# Altium project L-LRMAM36-FANN4-DK01_V03.PrjPCB
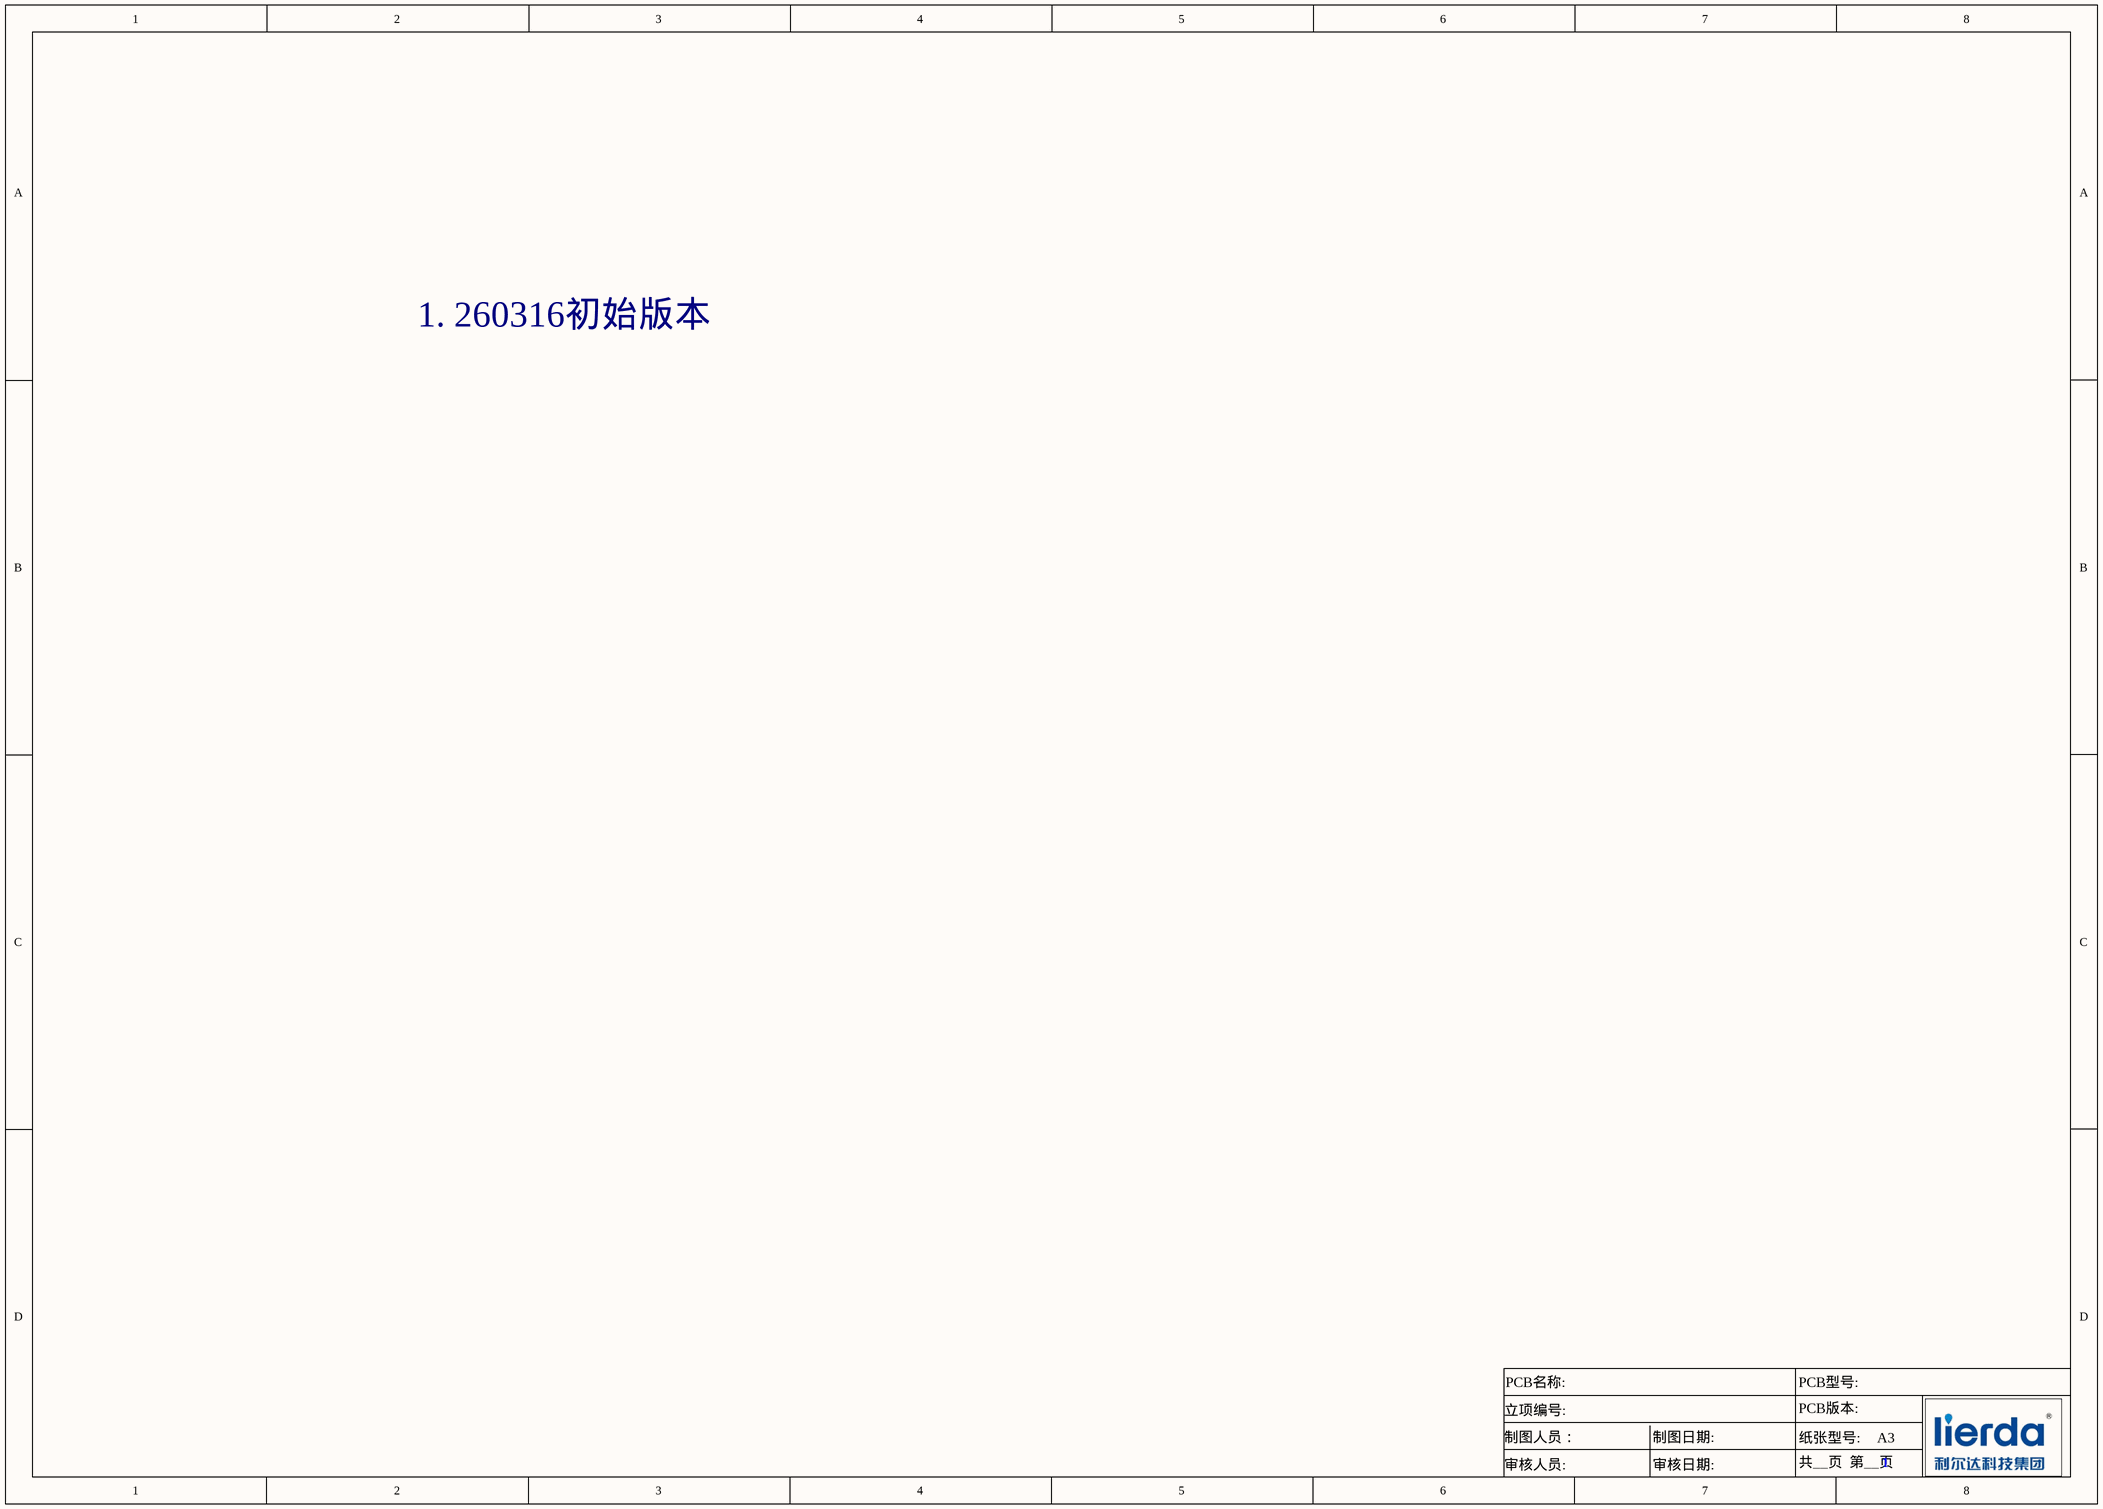
[diagram p0: 01_ChangeLIST.SchDoc]
6 sheets, 276 parts. Net scope: global (net labels, ports and power ports of the same name join across sheets).
Board files: L-LRMAM36-FANN4-DK01-0402-03.PcbDoc, L-LRMAM36-FANN4-DK01_V03.PcbDoc
Sheets:
  01_ChangeLIST.SchDoc
  02_Block.SchDoc
  03_Power_260316_V02.SchDoc
  04_Function_260316_V02.SchDoc
  05_Codec&PA.SchDoc
  06_LCD&Camera_interface.SchDoc

## Sheet 01_ChangeLIST.SchDoc
size A3

### Notes on the sheet
- 1. 260316初始版本
- PCB名称:
- PCB型号:
- 制图人员：
- 立项编号:
- 制图日期:
- PCB版本:
- 纸张型号:
- A3
- 审核人员:
- 审核日期:
- 共__页  第__页
- 1

## Sheet 02_Block.SchDoc
size A3
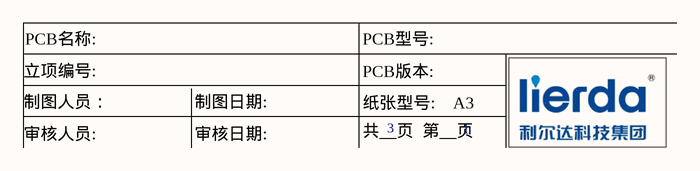
[diagram p1: 02_Block.SchDoc]

### Notes on the sheet
- PCB名称:
- PCB型号:
- 制图人员：
- 立项编号:
- 制图日期:
- 纸张型号:
- PCB版本:
- 3
- A3
- 1
- 审核人员:
- 审核日期:
- 共__页  第__页

## Sheet 03_Power_260316_V02.SchDoc
size A3
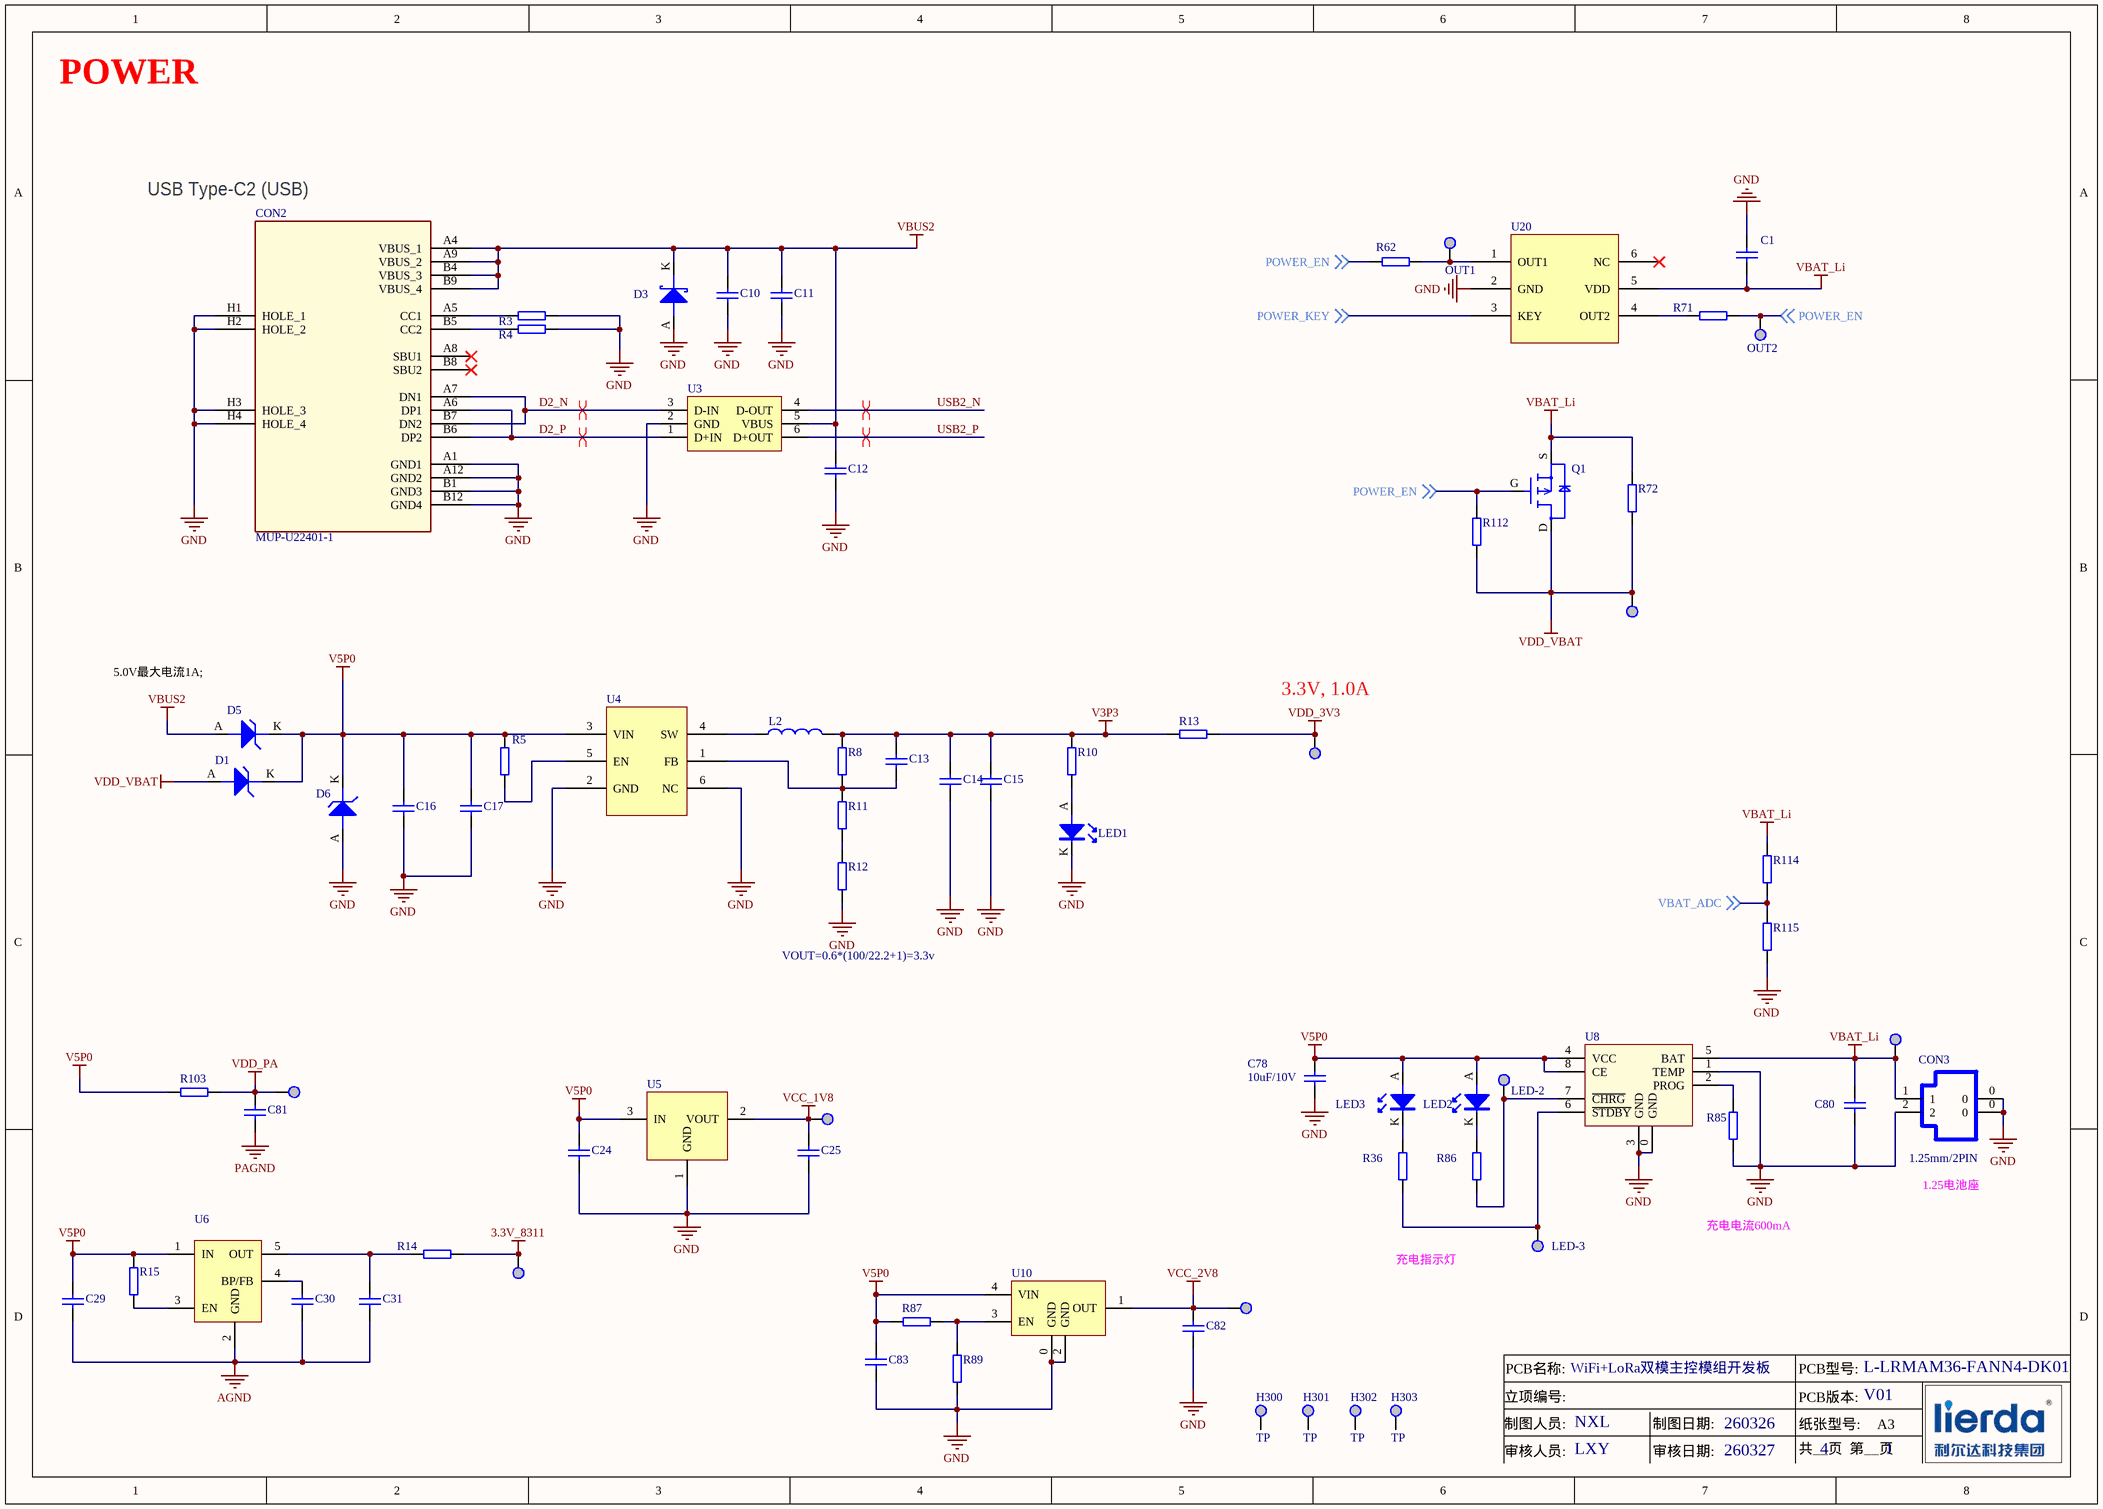
[diagram p2: 03_Power_260316_V02.SchDoc]

### Parts
C1  2.2uF  [0402C_0.4D]  (value not drawn)
C10  4.7uF/16V  [0402C_0.4D]  (value not drawn)
C11  0.1uF/16V  [0402C_0.4D]  (value not drawn)
C12  0.1uF  [0402C_0.4D]  (value not drawn)
C13  20pF  [0402C_0.4D]  (value not drawn)
C14  22uF  [0603C_0.6D]  (value not drawn)
C15  10uF/10V  [0402C_0.4D]  (value not drawn)
C16  4.7uF/16V  [0402C_0.4D]  (value not drawn)
C17  1uF/16V  [0402C_0.4D]  (value not drawn)
C24  1uF/16V  [0402C_0.4D]  (value not drawn)
C25  1uF/16V  [0402C_0.4D]  (value not drawn)
C29  1uF/16V  [0402C_0.4D]  (value not drawn)
C30  10nF  [0402C_0.4D]  (value not drawn)
C31  1uF/16V  [0402C_0.4D]  (value not drawn)
C78  产品型号: 10uF/10V  [0402C_0.4D]  (hidden comment: CAP-NP)
C80  CAP-NP  [0402C_0.4D]  (value not drawn)
C81  10uF/10V  [0402C_0.4D]  (value not drawn)
C82  1uF/16V  [0402C_0.4D]  (value not drawn)
C83  2.2uF  [0402C_0.4D]  (value not drawn)
CON2  产品型号: MUP-U22401-1  [USB-TYPEC-U22401-1]  (hidden comment: USB-TYPE C-16)
CON3  FPC-2  [SMD-1.25-2P]  (value not drawn)
D1  DIODE-ZD  [SOD-123-FL]  (value not drawn)
D3  DIODE-TVS  [UDFN2(1610)]  (value not drawn)
D5  DIODE-ZD  [SOD-123-FL]  (value not drawn)
D6  DIODE-ZD  [SOD-123]  (value not drawn)
H300  TP  [M2.5]
H301  TP  [M2.5]
H302  TP  [M2.5]
H303  TP  [M2.5]
L2  2.2uH/20%/2.0*1.2*0.8/1.7A/146mΩ  [0805L_0.7D-NB]  (value not drawn)
LED1  *  [D0603]  (value not drawn)
LED2  红/25mA  [D0603]  (value not drawn)
LED3  绿/25mA  [D0603]  (value not drawn)
LED-2  MARK  [TEST]  (value not drawn)
LED-3  MARK  [TEST]  (value not drawn)
OUT1  MARK  [TEST]  (value not drawn)
OUT2  MARK  [TEST]  (value not drawn)
Q1  P-MOS-D1  [SOT-23-3G]  (value not drawn)
R3  5.1K/1%  [0402R_0.4D]  (value not drawn)
R4  5.1K/1%  [0402R_0.4D]  (value not drawn)
R5  51KΩ/1%  [0402R_0.4D]  (value not drawn)
R8  100KΩ/1%  [0402R_0.4D]  (value not drawn)
R10  620R  [0402R_0.4D]  (value not drawn)
R11  22KΩ  [0402R_0.4D]  (value not drawn)
R12  220Ω/1%  [0402R_0.4D]  (value not drawn)
R13  RES  [0805R_0.6D]  (value not drawn)
R14  0Ω/1%  [0402R_0.4D]  (value not drawn)
R15  10KΩ/5%  [0402R_0.4D]  (value not drawn)
R36  RES  [0402R_0.4D]  (value not drawn)
R62  0Ω/1%  [0402R_0.4D]  (value not drawn)
R71  0Ω/1%  [0402R_0.4D]  (value not drawn)
R72  RES  [0805R_0.6D]  (value not drawn)
R85  RES  [0402R_0.4D]  (value not drawn)
R86  RES  [0402R_0.4D]  (value not drawn)
R87  10KΩ/5%  [0402R_0.4D]  (value not drawn)
R89  10KΩ/5%  [0402R_0.4D]  (value not drawn)
R103  RES  [0805R_0.6D]  (value not drawn)
R112  NC  [0402R_0.4D]  (value not drawn)
R114  1MΩ/1%  [0402R_0.4D]  (value not drawn)
R115  1MΩ/1%  [0402R_0.4D]  (value not drawn)
TP_LDO1  TP  [TEST]  (value not drawn)
TP_VBAT1  TP  [TEST]  (value not drawn)
U3  USBLC6-2SC6  [SOT-23-6P]  (value not drawn)
U4  SGM61020XKB6G/TR  [SOT-563-6]  (value not drawn)
U5  LDO-1G2OUT3IN  [SOT-23-3P]  (value not drawn)
U6  SGM2028-XYN5G/TR  [SOT-23-5P]  (value not drawn)
U8  TP4056  [SOP-8(1.27)-GND]  (value not drawn)
U10  ETA5053V280DF1E  [XDFN4-1X1]  (value not drawn)
U20  EC190708-4-A427  [SOT-23-6P]  (value not drawn)
VDD_1V8  MARK  [TEST]  (value not drawn)
VDD_2V8  MARK  [TEST]  (value not drawn)
VDD_PA  MARK  [TEST]  (value not drawn)
VDD_VBAT  MARK  [TEST]  (value not drawn)
VDD_WiFi  MARK  [TEST]  (value not drawn)

### Nets
3.3V_8311: R14.2 TP_LDO1.1
AGND: C29.1 C30.1 C31.1 U6.2(GND)  [project net MIC_N]
GND: C1.1 C10.1 C11.1 C12.1 C14.1 C15.1 C16.1 C17.1 C24.1 C25.1 C78.1 C80.1 C82.1 C83.1 CON2.A1(GND1) CON2.A12(GND2) CON2.B1(GND3) CON2.B12(GND4) CON2.H1(HOLE_1) CON2.H2(HOLE_2) CON2.H3(HOLE_3) CON2.H4(HOLE_4) CON3.0 CON3.2 D3.A D6.A LED1.K R3.1 R4.1 R12.1 R85.1 R89.1 R115.1 U3.2(GND) U4.2(GND) U4.6(NC) U5.1(GND) U8.0(GND) U8.1(TEMP) U8.3(GND) U10.0(GND) U10.2(GND) U20.2(GND)
PAGND: C81.1
V3P3: C13.2 C14.2 C15.2 L2.2 R8.2 R10.2 R13.2
V5P0: C16.2 C17.2 C24.2 C29.2 C78.2 C83.2 D1.K D5.K D6.K LED2.A LED3.A R5.2 R15.2 R87.2 R103.2 U4.3(VIN) U5.3(IN) U6.1(IN) U8.4(VCC) U8.8(CE) U10.4(VIN)
VBAT_Li: C1.2 C80.2 CON3.1 Q1.S R72.1 R114.2 TP_VBAT1.1 U8.5(BAT) U20.5(VDD)
VBUS2: C10.2 C11.2 C12.2 CON2.A4(VBUS_1) CON2.A9(VBUS_2) CON2.B4(VBUS_3) CON2.B9(VBUS_4) D3.K D5.A U3.5(VBUS)
VCC_1V8: C25.2 U5.2(VOUT) VDD_1V8.1
VCC_2V8: C82.2 U10.1(OUT) VDD_2V8.1
VDD_3V3: R13.1 VDD_WiFi.1
VDD_PA: C81.2 R103.1 VDD_PA.1
VDD_VBAT: D1.A Q1.D R72.2 R112.1 VDD_VBAT.1
D2_N: CON2.A7(DN1) CON2.B7(DN2) U3.3(D-IN)
D2_P: CON2.A6(DP1) CON2.B6(DP2) U3.1(D+IN)
POWER_EN: OUT2.1 Q1.G R62.1 R71.2 R112.2 ; off-sheet POWER_EN
POWER_KEY: U20.3(KEY) ; off-sheet POWER_KEY
USB2_N: U3.4(D-OUT)
USB2_P: U3.6(D+OUT)
VBAT_ADC: R114.1 R115.2 ; off-sheet VBAT_ADC
NetC13_1: C13.1 R8.1 R11.2 U4.1(FB)
NetC30_2: C30.2 U6.4(BP/FB)
NetC31_2: C31.2 R14.1 U6.5(OUT)
NetCON2_A5: CON2.A5(CC1) R3.2
NetCON2_B5: CON2.B5(CC2) R4.2
NetL2_1: L2.1 U4.4(SW)
NetLED1_A: LED1.A R10.1
NetLED2_K: LED2.K R86.2
NetLED3_K: LED3.K R36.2
NetLED-2_1: LED-2.1 R86.1 U8.7(~{CHRG})
NetLED-3_1: LED-3.1 R36.1 U8.6(~{STDBY})
NetOUT1_1: OUT1.1 R62.2 U20.1(OUT1)
NetR5_1: R5.1 U4.5(EN)
NetR11_1: R11.1 R12.2
NetR15_1: R15.1 U6.3(EN)
NetR71_1: R71.1 U20.4(OUT2)
NetR85_2: R85.2 U8.2(PROG)
NetR87_1: R87.1 R89.2 U10.3(EN)

Not connected (* = marked no-connect by the designer): CON2 A8(SBU1)* B8(SBU2)*; H300 1; H301 1; H302 1; H303 1; U20 6(NC)*

### Layout directives
differential pair: D2_N, D2_P, USB2_N, USB2_P

### Notes on the sheet
- POWER
- (near CON2) USB Type-C2 (USB)
- 5.0V最大电流1A;
- (near VDD_WiFi) 3.3V, 1.0A
- VOUT=0.6*(100/22.2+1)=3.3v
- 1.25电池座
- 充电指示灯
- 充电电流600mA
- PCB名称:
- WiFi+LoRa双模主控模组开发板
- PCB型号:
- L-LRMAM36-FANN4-DK01
- 制图人员:
- 审核人员:
- 立项编号:
- NXL
- LXY
- 制图日期:
- 审核日期:
- 260326
- 260327
- 纸张型号:
- 共__页  第__页
- PCB版本:
- 4
- V01
- A3
- 1

### Library data of the parts
C1 C16 C83 = 1405002483: 4.7uF/16V/20%/X5R; 产品型号: CL05A475MO5NUNC; 品名: 陶瓷电容; 原厂品牌: SAMSUNG电容; 封装: 0402; 存货编码: 1405002483
C10 = 1405002483: 4.7uF/16V/20%/X5R; 产品型号: CL05A475MO5NUNC; 器件名称: 陶瓷电容; 原厂品牌: SAMSUNG电容; 封装: 0402; 存货编码: 1405002483
C11 = 1405000464: 0.1uF/16V/10%/X7R; 产品型号: CL05B104KO5NNNC; 品名: 陶瓷电容; 原厂品牌: SAMSUNG; 封装: 0402; 物料状态: 优选; 存货编码: 1405000464
C12 = 1405000041: 0.1uF/16V/10%/X7R; 产品型号: CC0402KRX7R7BB104; 器件名称: 陶瓷电容; 原厂品牌: YAGEO; 封装: 0402; 存货编码: 1405000041
C13 = 1405001560: 20pF/50V/5%/C0G; 产品型号: V200J0402C0G500NBT; 品名: 陶瓷电容; 原厂品牌: 微容VIIYONG; 封装: 0402; 物料状态: 优选; 存货编码: 1405001560
C14 = 1405001346: 22uF/10V/20%/X5R; 产品型号: CL10A226MP8NUN#; 品名: 陶瓷电容; 原厂品牌: SAMSUNG电容; 封装: 0603; 存货编码: 1405001346
C15 C81 = 1405001308: 10uF/10V/20%/X5R; 产品型号: CL05A106MP5NUNC; 品名: 陶瓷电容; 原厂品牌: SAMSUNG电容; 封装: 0402; 存货编码: 1405001308
C17 C24 C25 C29 C31 C82 = 1405004038: 1uF/16V/10%/X5R; 产品型号: CL05A105KO5NNNC; 品名: 陶瓷电容; 原厂品牌: SAMSUNG电容; 封装: 0402; 存货编码: 1405004038
C30 = 1405005232: 10nF/16V/10%/X7R; 产品型号: V103K0402X7R160NBT; 品名: 陶瓷电容; 原厂品牌: 微容VIIYONG; 封装: 0402; 物料状态: 优选; 存货编码: 1405005232
C78 C80 = 1405001308: 10uF/10V/20%/X5R; 品名: 陶瓷电容; 原厂品牌: 三星; 封装: 0402; 物料状态: 优选; 存货编码: 1405001308
  C80: 产品型号: 10uF/10V
CON2 = 1416004328: TYPE C; 品名: USB连接器; 原厂品牌: 德海威; 封装: SMD; 物料状态: 优选; 存货编码: 1416004328
CON3 = 1416001814: 1.25mm/2PIN; 品名: 线对板连接器; 原厂品牌: 肯耐特; 封装: SMD; 物料状态: 优选; 产品型号: 1.25mm/2PIN; 存货编码: 1416001814
D1 D5 = 1409001653: 40V/3A; 产品型号: S34; 品名: 肖特基二极管; 原厂品牌: YJ; 封装: SOD-123FL; 物料状态: 优选; 存货编码: 1409001653
D3 = 1409004319: 1通道; 产品型号: WS6.3DPX; 品名: ESD保护器件; 原厂品牌: WAYON（维安）; 封装: DFN1610-2L; 物料状态: 优选; 存货编码: 1409004319
D6 = 1409000809: 5.6V/0.5W; 产品型号: LBZT52C5V6T1G; 品名: 稳压二极管; 原厂品牌: LRC; 物料状态: 优选; 存货编码: 1409000809; 封装: SOD-123
L2 = 1404002926: 产品型号: SKFB201208PA2R2M; 品名: 功率电感; 原厂品牌: 三体Scientic; 封装: 0805; 物料状态: 试用; 存货编码: 1404002926
LED1 = 1409000426: 红/25mA; 产品型号: 19-213SURC-S530-A2-TR8; 器件名称: 发光二极管; 原厂品牌: EVERLIGHT; 封装: 0603; 存货编码: 1409000426
LED2 LED3 = 1409000351: 绿/25mA/112-285mcd; 产品型号: 19-217/GHC-YR1S2/6T; 品名: LED发光二极管; 原厂品牌: EVERLIGHT; 封装: 0603; 物料状态: 优选; 存货编码: 1409000351
Q1 = 1412000739: PMOS/30V/4.2A; 产品型号: CJ3401; 品名: MOS管; 原厂品牌: CJ; 封装: SOT-23; 物料状态: 优选; 存货编码: 1412000739
R3 R4 = 1408001245: 5.1K/1%/100PPM; 产品型号: RC0402FR-075K1L; 品名: 厚膜贴片电阻; 原厂品牌: YAGEO; 封装: 0402; 存货编码: 1408001245
R5 = 1408001200: 产品型号: 0402WGF5102TCE; 品名: 厚膜贴片电阻; 原厂品牌: Uniohm; 封装: 0402; 物料状态: 优选; 存货编码: 1408001200
R8 = 1408000126: 产品型号: 0402WGF1003TCE; 品名: 厚膜贴片电阻; 原厂品牌: Uniohm; 封装: 0402; 物料状态: 优选; 存货编码: 1408000126
R10 = 1408006136: 620R/5%; 产品型号: 0402WGJ0621TCE; 品名: 厚膜贴片电阻; 原厂品牌: Uniohm; 封装: 0402; 物料状态: 限用; 存货编码: 1408006136
R11 R112 = 1408000783: 22KΩ/1%; 产品型号: 0402WGF2202TCE; 品名: 厚膜贴片电阻; 原厂品牌: Uniohm; 封装: 0402; 物料状态: 优选; 存货编码: 1408000783
R12 = 1408001062: 产品型号: RC0402FR-07220RL; 品名: 厚膜贴片电阻; 原厂品牌: YAGEO; 封装: 0402; 物料状态: 优选; 存货编码: 1408001062
R13 R72 = 1408000487: 0Ω/1%; 产品型号: 0R; 品名: 厚膜贴片电阻; 原厂品牌: Uniohm; 封装: 0805; 物料状态: 优选; 存货编码: 1408000487
R14 R62 R71 = 1408000124: 产品型号: 0402WGF0000TCE; 品名: 厚膜贴片电阻; 原厂品牌: Uniohm; 封装: 0402; 物料状态: 优选; 存货编码: 1408000124
R15 R87 R89 = 1408000526: 产品型号: 0402WGJ0103TCE; 品名: 厚膜贴片电阻; 原厂品牌: Uniohm; 封装: 0402; 物料状态: 优选; 存货编码: 1408000526
R36 R86 = 1408000535: 1KΩ/5%; 产品型号: 620R; 品名: 厚膜贴片电阻; 原厂品牌: Uniohm; 封装: 0402; 物料状态: 优选; 存货编码: 1408000535
R85 = 1408000223: 2KΩ/5%; 产品型号: 2K; 品名: 厚膜贴片电阻; 原厂品牌: Uniohm; 封装: 0402; 物料状态: 优选; 存货编码: 1408000223
R103 = 1408000487: 0Ω/1%; 品名: 厚膜贴片电阻; 原厂品牌: Uniohm; 封装: 0805; 物料状态: 优选; 存货编码: 1408000487
R114 R115 = 1408000713: 产品型号: 0402WGF1004TCE; 品名: 厚膜贴片电阻; 原厂品牌: Uniohm; 封装: 0402; 物料状态: 优选; 存货编码: 1408000713
U3 = 1410003301: USB保护芯片; 品名: ESD保护二极管; 原厂品牌: ST; 封装: SOT-23-6; 产品型号: USBLC6-2SC6; 存货编码: 1410003301
U5 = 1407003557: 1.8V/250mA/1.7-7.5V; 产品型号: SGM2034-1.8YN3G/TR; 品名: 低压差线性稳压器; 原厂品牌: 圣邦微; 封装: SOT-23-3; 物料状态: 优选; 存货编码: 1407003557
U6 = 1407001780: 3.3V/500mA/2.5-5.5V; 产品型号: SGM2028-3.3YN5G/TR; 品名: 低压差线性稳压器; 原厂品牌: SGMICRO; 封装: SOT-23-5; 物料状态: 优选; 存货编码: 1407001780
U8 = 1407000458: -/1A; 品名: 电池管理IC; 原厂品牌: 南京拓微; 封装: SOP8; 物料状态: 优选; 产品型号: TP4056; 存货编码: 1407000458
U10 = 1407004220: 2.8V/300mA/1.6-6V; 品名: 低压差线性稳压器; 原厂品牌: 钰泰科技; 封装: DFN4; 物料状态: 优选; 产品型号: ETA5053V280DF1E; 存货编码: 1407004220
H300-H303 TP_LDO1 TP_VBAT1 = TP: 产品型号: TP

## Sheet 04_Function_260316_V02.SchDoc
size A3
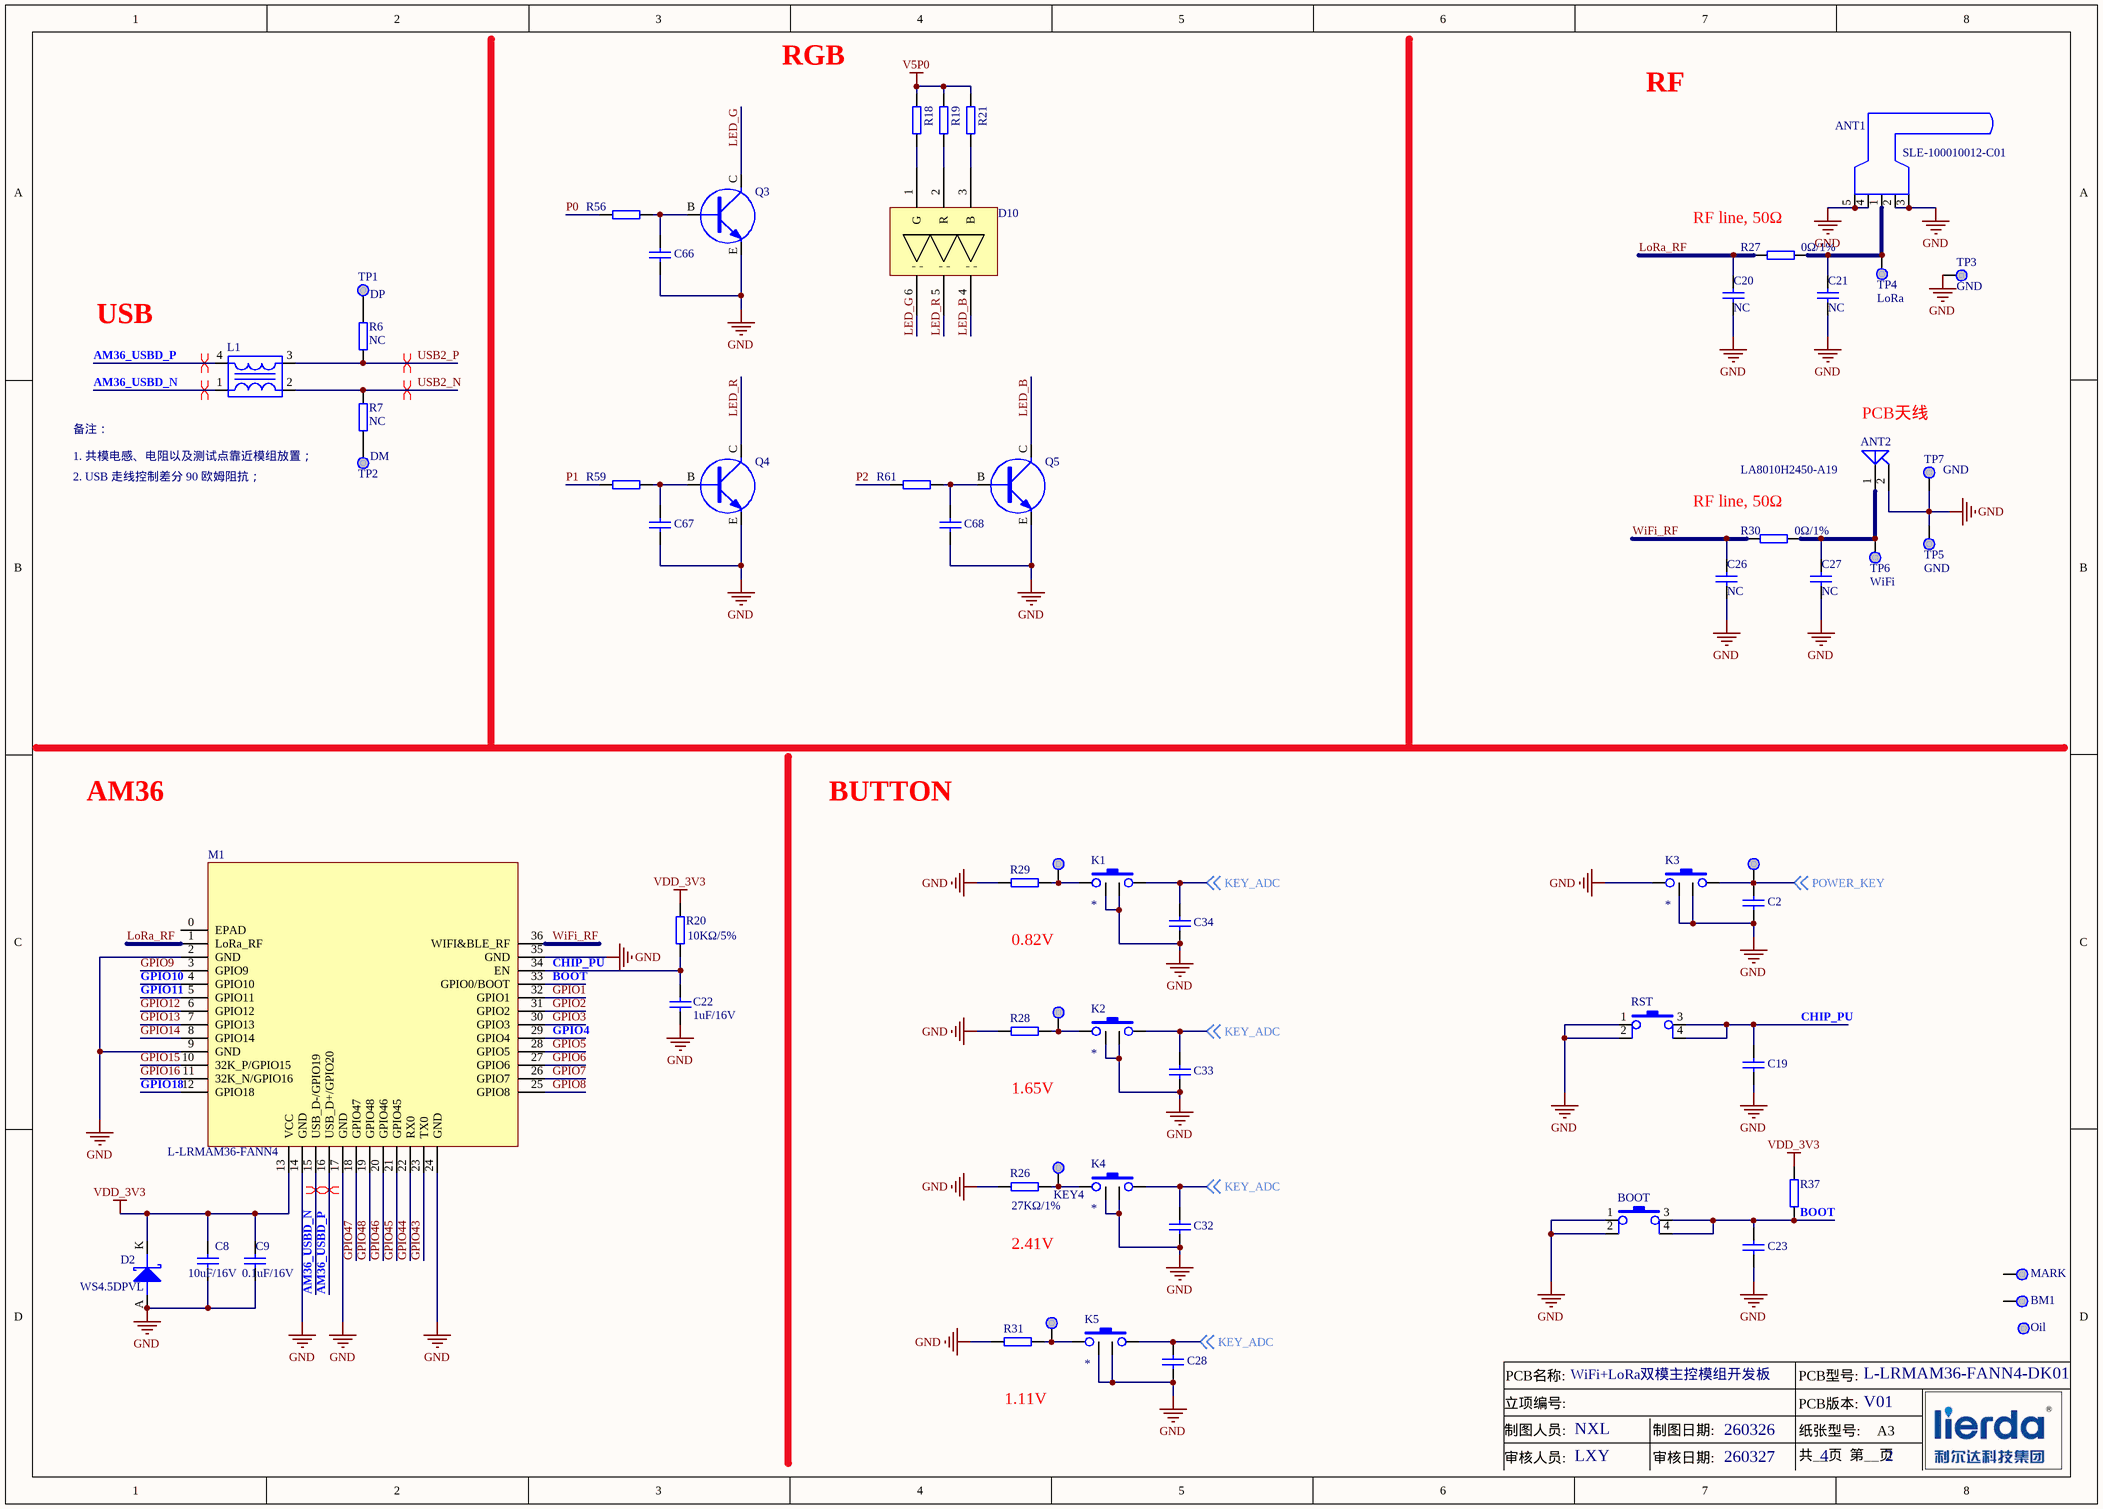
[diagram p3: 04_Function_260316_V02.SchDoc]

### Parts
ANT1  产品型号: SLE-100010012-C01  [SMA-SMD]  (hidden comment: ANT P5)
ANT2  产品型号: LA8010H2450-A19  [2.4G_5.5X12]  (hidden comment: ANT 2P)
BM1  BadMARK  [Bad Mark]  (value not drawn)
BOOT  BUTTON-4  [SW-4.2X3.2-4P-S]  (value not drawn)
C2  NC  [0402C_0.4D]  (value not drawn)
C8  10uF/16V  [0402C_0.4D]
C9  0.1uF/16V  [0402C_0.4D]
C19  100pF  [0402C_0.4D]  (value not drawn)
C20  NC  [0402C_0.4D]
C21  NC  [0402C_0.4D]
C22  1uF/16V  [0402C_0.4D]
C23  100pF  [0402C_0.4D]  (value not drawn)
C26  NC  [0402C_0.4D]
C27  NC  [0402C_0.4D]
C28  100pF  [0402C_0.4D]  (value not drawn)
C32  100pF  [0402C_0.4D]  (value not drawn)
C33  100pF  [0402C_0.4D]  (value not drawn)
C34  100pF  [0402C_0.4D]  (value not drawn)
C66  100pF  [0402C_0.4D]  (value not drawn)
C67  100pF  [0402C_0.4D]  (value not drawn)
C68  100pF  [0402C_0.4D]  (value not drawn)
D2  产品型号: WS4.5DPVL  [UDFN2(1610)]  (hidden comment: DIODE-TVS)
D10  MHP5050DRGBCT  [D5050-RGB]  (value not drawn)
K1  BUTTON-2-2  [1188E-1W3-V-T/R]  (value not drawn)
K2  BUTTON-2-2  [1188E-1W3-V-T/R]  (value not drawn)
K3  BUTTON-2-2  [1188E-1W3-V-T/R]  (value not drawn)
K4  BUTTON-2-2  [1188E-1W3-V-T/R]  (value not drawn)
K5  BUTTON-2-2  [1188E-1W3-V-T/R]  (value not drawn)
KEY3  MARK  [TEST]  (value not drawn)
KEY4  MARK  [TEST]  (value not drawn)
KEY5  MARK  [TEST]  (value not drawn)
KEY6  MARK  [TEST]  (value not drawn)
KEY7  MARK  [TEST]  (value not drawn)
L1  DLM0NSN900HY2D  [L-0.85X0.65]  (value not drawn)
M1  L-LRMAM36-FANN4  [L-LRMAM36-FANN4]
MK1  MARK  [MARK]
Oil1  Oil  [White oil-9X9]
Q3  NPN  [SOT-723-3A]  (value not drawn)
Q4  NPN  [SOT-723-3A]  (value not drawn)
Q5  NPN  [SOT-723-3A]  (value not drawn)
R6  产品型号: NC  [0201_0.25D]  (hidden comment: RES-NBOM)
R7  产品型号: NC  [0201_0.25D]  (hidden comment: RES-NBOM)
R18  620R  [0402R_0.4D]  (value not drawn)
R19  620R  [0402R_0.4D]  (value not drawn)
R20  10KΩ/5%  [0402R_0.4D]
R21  620R  [0402R_0.4D]  (value not drawn)
R26  27KΩ/1%  [0402R_0.4D]
R27  0Ω/1%  [0402R_0.4D]
R28  10KΩ/1%  [0402R_0.4D]  (value not drawn)
R29  3.3KΩ/1%  [0402R_0.4D]  (value not drawn)
R30  0Ω/1%  [0402R_0.4D]
R31  5.1KΩ/1%  [0402R_0.4D]  (value not drawn)
R37  10KΩ/1%  [0402R_0.4D]  (value not drawn)
R56  0Ω/1%  [0402R_0.4D]  (value not drawn)
R59  0Ω/1%  [0402R_0.4D]  (value not drawn)
R61  0Ω/1%  [0402R_0.4D]  (value not drawn)
RST  BUTTON-4  [SW-4.2X3.2-4P-S]  (value not drawn)
TP1  DP  [TEST]
TP2  DM  [TEST]
TP3  GND  [TEST]
TP4  LoRa  [TEST]
TP5  GND  [TEST]
TP6  WiFi  [TEST]
TP7  GND  [TEST]

### Nets
GND: ANT1.2 ANT1.3 ANT1.4 ANT1.5 ANT2.2 BOOT.1 BOOT.2 C2.1 C8.1 C9.1 C19.1 C20.1 C21.1 C22.1 C23.1 C26.1 C27.1 C28.1 C32.1 C33.1 C34.1 C66.1 C67.1 C68.1 D2.A K1.0 K2.0 K3.0 K3.1 K4.0 K5.0 M1.2(GND) M1.9(GND) M1.14(GND) M1.17(GND) M1.24(GND) M1.35(GND) Q3.E Q4.E Q5.E R26.1 R28.2 R29.1 R31.1 RST.1 RST.2 TP3.1 TP5.1 TP7.1
V5P0: R18.2 R19.2 R21.2
VDD_3V3: C8.2 C9.2 D2.K M1.13(VCC) R20.2 R37.1
AM36_USBD_N: L1.1 M1.15(USB_D-/GPIO19)
AM36_USBD_P: L1.4 M1.16(USB_D+/GPIO20)
BOOT: BOOT.3 BOOT.4 C23.2 M1.33(GPIO0/BOOT) R37.2
CHIP_PU: C19.2 C22.2 M1.34(EN) R20.1 RST.3 RST.4
GPIO1: M1.32(GPIO1)
GPIO2: M1.31(GPIO2)
GPIO3: M1.30(GPIO3)
GPIO4: M1.29(GPIO4)
GPIO5: M1.28(GPIO5)
GPIO6: M1.27(GPIO6)
GPIO7: M1.26(GPIO7)
GPIO8: M1.25(GPIO8)
GPIO9: M1.3(GPIO9)
GPIO10: M1.4(GPIO10)
GPIO11: M1.5(GPIO11)
GPIO12: M1.6(GPIO12)
GPIO13: M1.7(GPIO13)
GPIO14: M1.8(GPIO14)
GPIO15: M1.10(32K_P/GPIO15)
GPIO16: M1.11(32K_N/GPIO16)
GPIO18: M1.12(GPIO18)
GPIO43: M1.23(TX0)
GPIO44: M1.22(RX0)
GPIO45: M1.21(GPIO45)
GPIO46: M1.20(GPIO46)
GPIO47: M1.18(GPIO47)
GPIO48: M1.19(GPIO48)
KEY_ADC: C28.2 C32.2 C33.2 C34.2 K1.2 K2.2 K4.2 K5.2 ; off-sheet KEY_ADC
LED_B: D10.4(|) Q5.C
LED_G: D10.6(|) Q3.C
LED_R: D10.5(|) Q4.C
LoRa_RF: C20.2 M1.1(LoRa_RF) R27.1
P0: R56.1
P1: R59.1
P2: R61.1
POWER_KEY: C2.2 K3.2 KEY7.1 ; off-sheet POWER_KEY
USB2_N: L1.2 R7.2
USB2_P: L1.3 R6.1
WiFi_RF: C26.2 M1.36(WIFI&BLE_RF) R30.1
NetANT1_1: ANT1.1 C21.2 R27.2 TP4.1
NetANT2_1: ANT2.1 C27.2 R30.2 TP6.1
NetC66_2: C66.2 Q3.B R56.2
NetC67_2: C67.2 Q4.B R59.2
NetC68_2: C68.2 Q5.B R61.2
NetD10_1: D10.1(G) R18.1
NetD10_2: D10.2(R) R19.1
NetD10_3: D10.3(B) R21.1
NetK1_1: K1.1 KEY6.1 R29.2
NetK2_1: K2.1 KEY5.1 R28.1
NetK4_1: K4.1 KEY4.1 R26.2
NetK5_1: K5.1 KEY3.1 R31.2
NetR6_2: R6.2 TP1.1
NetR7_1: R7.1 TP2.1

Not connected (* = marked no-connect by the designer): BM1 1; M1 0(EPAD); MK1 1

### Layout directives
differential pair: AM36_USBD_N, AM36_USBD_P, USB2_N, USB2_P

### Notes on the sheet
- RGB
- RF
- (near R27) RF line, 50Ω
- USB
- 备注：
- PCB天线
- 1. 共模电感、电阻以及测试点靠近模组放置；
- 2. USB 走线控制差分 90 欧姆阻抗；
- (near R30) RF line, 50Ω
- AM36
- BUTTON
- 0.82V
- 1.65V
- 2.41V
- PCB名称:
- WiFi+LoRa双模主控模组开发板
- PCB型号:
- (near Oil1) L-LRMAM36-FANN4-DK01
- 1.11V
- 制图人员:
- 审核人员:
- 立项编号:
- NXL
- LXY
- 制图日期:
- 审核日期:
- 260326
- 260327
- 纸张型号:
- 共__页  第__页
- PCB版本:
- 4
- V01
- A3
- 2

### Library data of the parts
ANT1 = 1416000904: 180°/SMA; 品名: 射频接头; 原厂品牌: 森岭; 封装: 其他; 物料状态: 优选; 存货编码: 1416000904
ANT2 = 1410029035: 2875MHz/2450MHz; 品名: 陶瓷天线; 原厂品牌: 嘉兴佳利; 封装: SMD; 物料状态: 限用; 存货编码: 1410029035
BOOT RST = 1414000735: 4.2*3.2*2.5mm; 产品型号: TS3443-0253B; 品名: 轻触开关; 原厂品牌: 苏州菀钛; 封装: SMD; 物料状态: 客定; 存货编码: 1414000735
C2 C19 C23 C28 C32-C34 C66-C68 = 1405000464: 0.1uF/16V/10%/X7R; 产品型号: CL05B104KO5NNNC; 品名: 陶瓷电容; 原厂品牌: SAMSUNG电容; 封装: 0402; 存货编码: 1405000464
C8 = 1405000464: 0.1uF/16V/10%/X7R; 产品型号: CL05B104KO5NNNC; 器件名称: 陶瓷电容; 原厂品牌: SAMSUNG电容; 封装: 0402; Value: 0.1uF; 存货编码: 1405000464
C9 = 1405002139: 10nF/50V/5%/X7R; 产品型号: CC0402JRX7R9BB103; 器件名称: 陶瓷电容; 原厂品牌: YAGEO; 封装: 0402; 存货编码: 1405002139
C20 C21 C26 C27 = 1405000291: 33pF/50V/5%/C0G; 产品型号: CC0402JRNPO9BN330; 品名: 陶瓷电容; 原厂品牌: YAGEO; 封装: 0402; 物料状态: 优选; 存货编码: 1405000291
C22 = 1405004038: as C17 on sheet 03_Power_260316_V02; 存货编码: 1405004038
D2 = 1409003028: 单向/4.5V/2160W; 品名: TVS管; 原厂品牌: WAYON（维安）; 封装: DFN1610-2L; 存货编码: 1409003028
K1-K5 = 1414000145: 7.8*3.5*3.5mm; 产品型号: *; 存货编码: 1414000145
L1 = 1404002237: 90Ω/0.1A/3.8Ω; 产品型号: DLM0NSM900HY2#; 品名: 扼流圈（共模）; 原厂品牌: MURATA; 封装: SMD; 项目类型: OEM; 存货编码: 1404002237
Q3-Q5 = 1412002731: NPN/100mA/50V/100mW; 产品型号: DTC143ZM; 品名: 三极管; 原厂品牌: CJ; 封装: SOT-723; 物料状态: 优选; 存货编码: 1412002731
R18 R19 R21 = 1408006136: as R10 on sheet 03_Power_260316_V02; 存货编码: 1408006136
R20 = 1408000526: as R15 on sheet 03_Power_260316_V02; 存货编码: 1408000526
R26 = 1408000585: 产品型号: 0402WGF2702TCE; 品名: 厚膜贴片电阻; 原厂品牌: Uniohm; 封装: 0402; 物料状态: 优选; 存货编码: 1408000585
R27 R30 R56 R59 R61 = 1408000124: as R14 on sheet 03_Power_260316_V02; 存货编码: 1408000124
R28 R37 = 1408000127: 产品型号: 0402WGF1002TCE; 品名: 厚膜贴片电阻; 原厂品牌: Uniohm; 封装: 0402; 物料状态: 优选; 存货编码: 1408000127
R29 = 1408001016: 产品型号: 0402WGF3301TCE; 品名: 厚膜贴片电阻; 原厂品牌: Uniohm; 封装: 0402; 物料状态: 优选; 存货编码: 1408001016
R31 = 1408001245: 产品型号: RC0402FR-075K1L; 品名: 厚膜贴片电阻; 原厂品牌: YAGEO; 封装: 0402; 物料状态: 优选; 存货编码: 1408001245
TP1-TP7 = MARK: 产品型号: MARK
KEY3-KEY7 MK1 = MARK
  MK1: 产品型号: MARK
Oil1 = Oil: 产品型号: Oil

## Sheet 05_Codec&PA.SchDoc
size A3
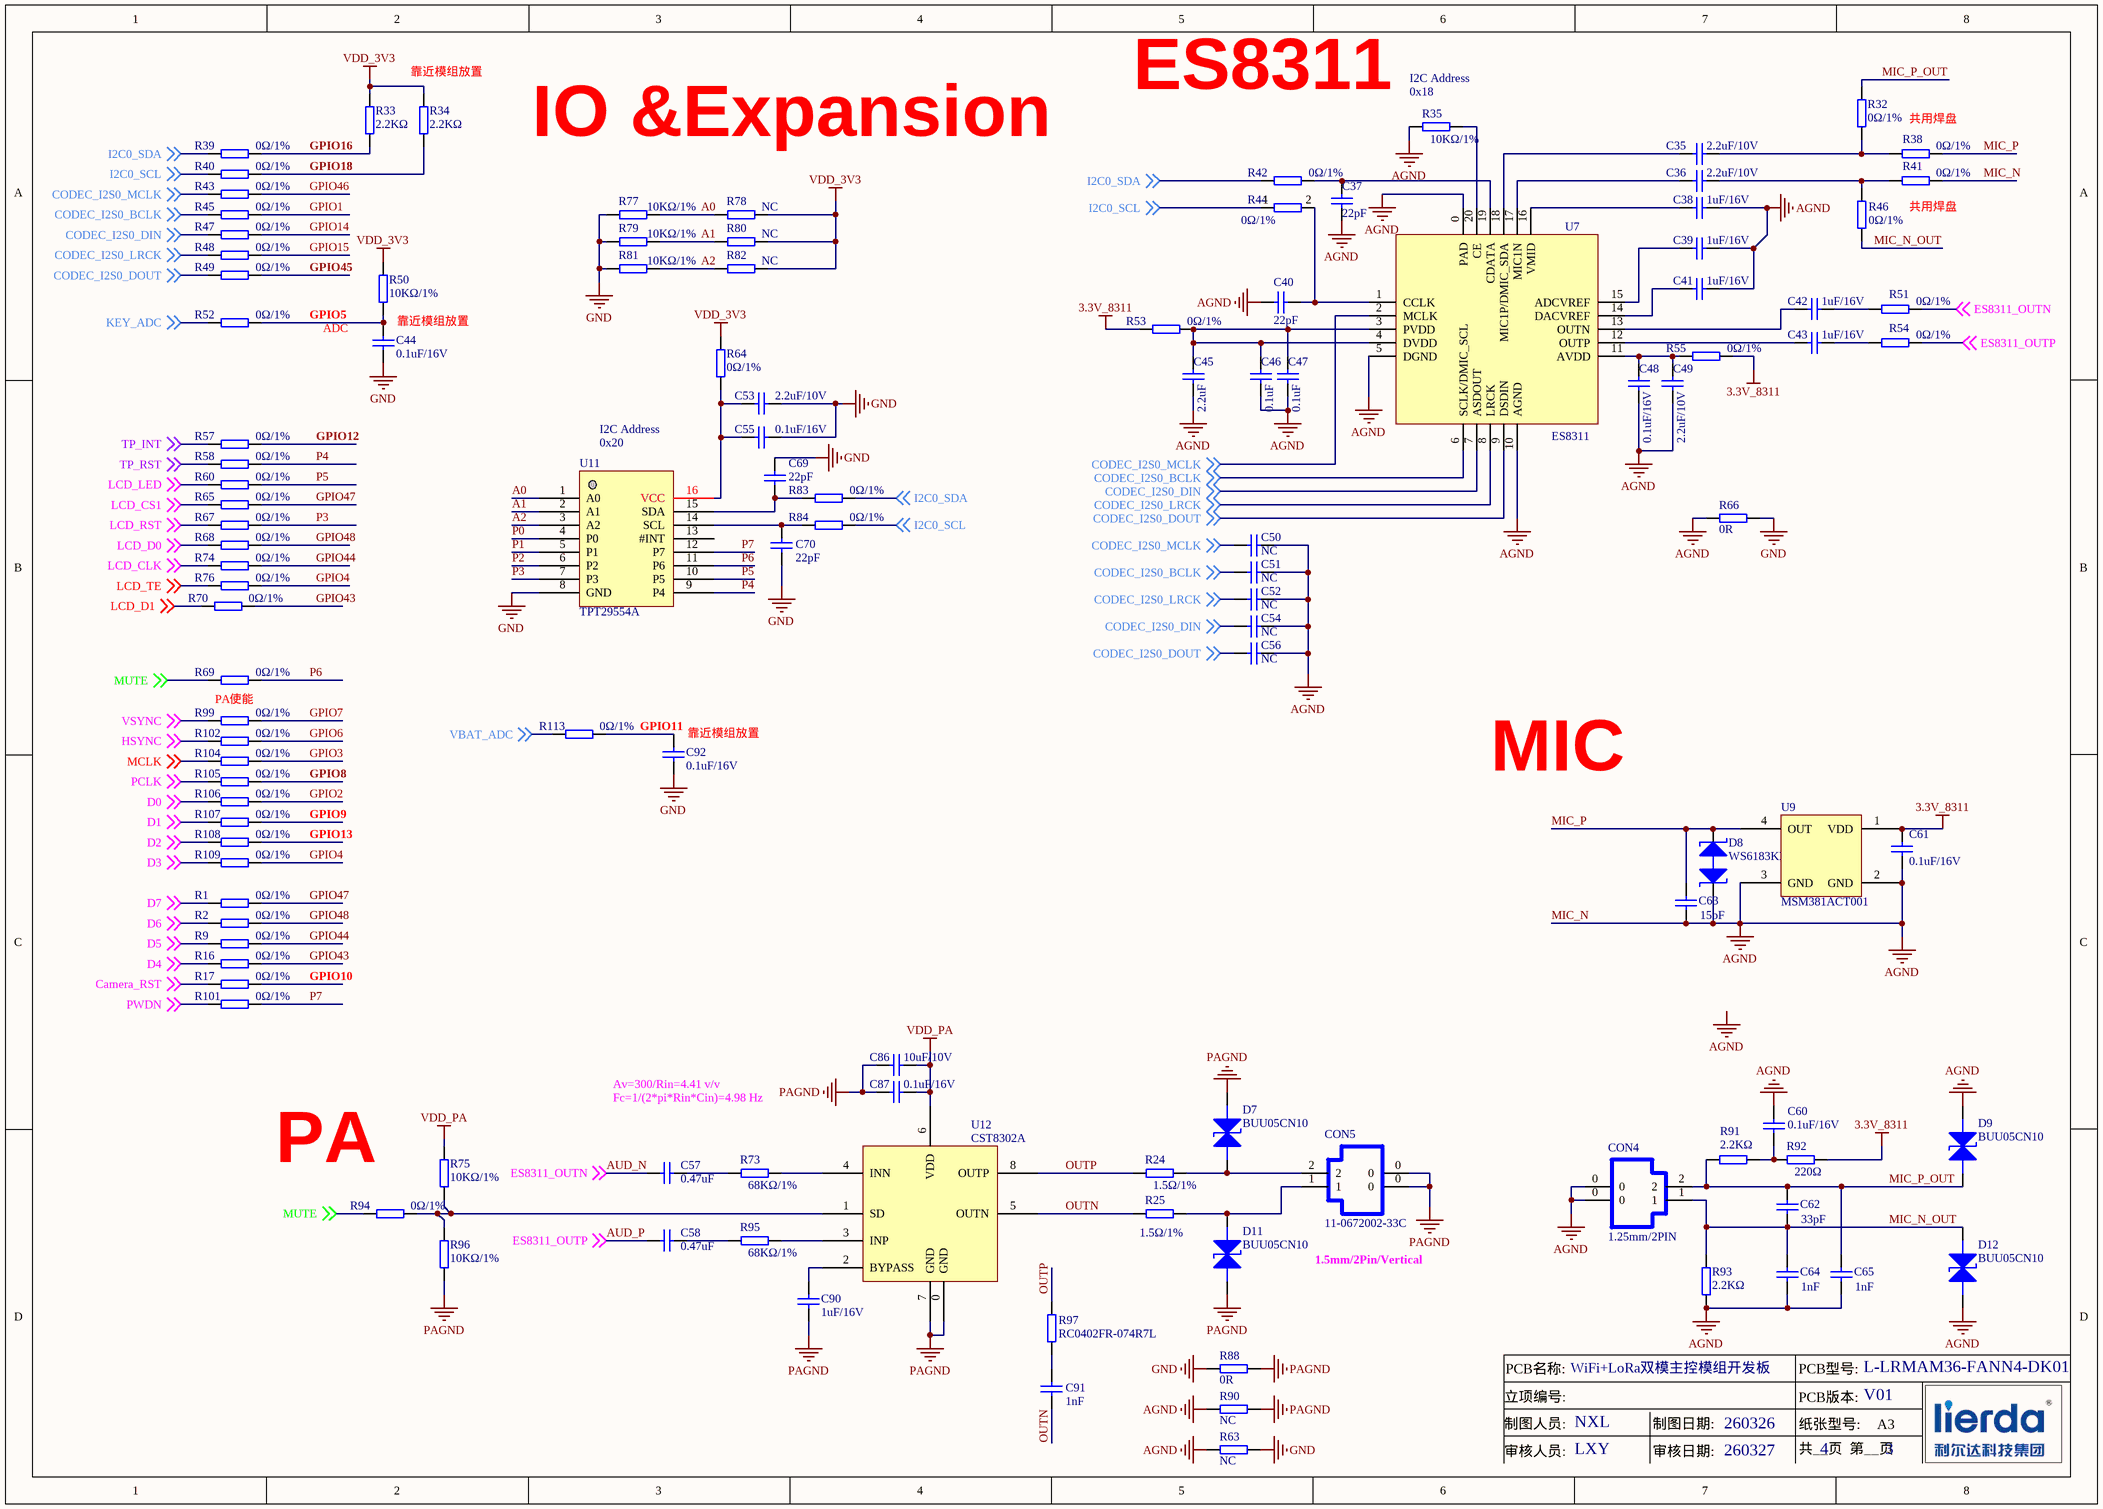
[diagram p4: 05_Codec&PA.SchDoc]

### Parts
C35  2.2uF/10V  [0402C_0.4D]
C36  2.2uF/10V  [0402C_0.4D]
C37  22pF  [0402C_0.4D]
C38  1uF/16V  [0402C_0.4D]
C39  1uF/16V  [0402C_0.4D]
C40  22pF  [0402C_0.4D]
C41  1uF/16V  [0402C_0.4D]
C42  1uF/16V  [0402C_0.4D]
C43  1uF/16V  [0402C_0.4D]
C44  0.1uF/16V  [0402C_0.4D]
C45  2.2uF  [0402C_0.4D]
C46  0.1uF  [0402C_0.4D]
C47  0.1uF  [0402C_0.4D]
C48  0.1uF/16V  [0402C_0.4D]
C49  2.2uF/10V  [0402C_0.4D]
C50  NC  [0402C_0.4D]
C51  NC  [0402C_0.4D]
C52  NC  [0402C_0.4D]
C53  2.2uF/10V  [0402C_0.4D]
C54  NC  [0402C_0.4D]
C55  0.1uF/16V  [0402C_0.4D]
C56  NC  [0402C_0.4D]
C57  0.47uF  [0402C_0.4D]
C58  0.47uF  [0402C_0.4D]
C60  0.1uF/16V  [0402C_0.4D]
C61  0.1uF/16V  [0402C_0.4D]
C62  33pF  [0402C_0.4D]
C63  15pF  [0402C_0.4D]
C64  1nF  [0402C_0.4D]
C65  1nF  [0402C_0.4D]
C69  22pF  [0402C_0.4D]
C70  22pF  [0402C_0.4D]
C86  10uF/10V  [0402C_0.4D]
C87  0.1uF/16V  [0402C_0.4D]
C90  1uF/16V  [0402C_0.4D]
C91  1nF  [0402C_0.4D]
C92  0.1uF/16V  [0402C_0.4D]
CON4  FPC-2  [SMD-1.25-2P]  (value not drawn)
CON5  11-0672002-33C  [SMD-1.25-2P]
D7  产品型号: BUU05CN10  [DFN1006-NP]  (hidden comment: DIODE-2TVS)
D8  WS6183KF  [DFN1006-NP]
D9  产品型号: BUU05CN10  [DFN1006-NP]  (hidden comment: DIODE-2TVS)
D11  产品型号: BUU05CN10  [DFN1006-NP]  (hidden comment: DIODE-2TVS)
D12  产品型号: BUU05CN10  [DFN1006-NP]  (hidden comment: DIODE-2TVS)
R1  0Ω/1%  [0402R_0.4D]
R2  0Ω/1%  [0402R_0.4D]
R9  0Ω/1%  [0402R_0.4D]
R16  0Ω/1%  [0402R_0.4D]
R17  0Ω/1%  [0402R_0.4D]
R24  1.5Ω/1%  [0402R_0.4D]
R25  1.5Ω/1%  [0402R_0.4D]
R32  0Ω/1%  [0402R_0.4D]
R33  2.2KΩ  [0402R_0.4D]
R34  2.2KΩ  [0402R_0.4D]
R35  10KΩ/1%  [0402R_0.4D]
R38  0Ω/1%  [0402R_0.4D]
R39  0Ω/1%  [0402R_0.4D]
R40  0Ω/1%  [0402R_0.4D]
R41  0Ω/1%  [0402R_0.4D]
R42  0Ω/1%  [0402R_0.4D]
R43  0Ω/1%  [0402R_0.4D]
R44  0Ω/1%  [0402R_0.4D]
R45  0Ω/1%  [0402R_0.4D]
R46  0Ω/1%  [0402R_0.4D]
R47  0Ω/1%  [0402R_0.4D]
R48  0Ω/1%  [0402R_0.4D]
R49  0Ω/1%  [0402R_0.4D]
R50  10KΩ/1%  [0402R_0.4D]
R51  0Ω/1%  [0402R_0.4D]
R52  0Ω/1%  [0402R_0.4D]
R53  0Ω/1%  [0402R_0.4D]
R54  0Ω/1%  [0402R_0.4D]
R55  0Ω/1%  [0402R_0.4D]
R57  0Ω/1%  [0402R_0.4D]
R58  0Ω/1%  [0402R_0.4D]
R60  0Ω/1%  [0402R_0.4D]
R63  产品型号: NC  [0805R_0.6D]  (hidden comment: RES)
R64  0Ω/1%  [0402R_0.4D]
R65  0Ω/1%  [0402R_0.4D]
R66  产品型号: 0R  [0805R_0.6D]  (hidden comment: RES)
R67  0Ω/1%  [0402R_0.4D]
R68  0Ω/1%  [0402R_0.4D]
R69  0Ω/1%  [0402R_0.4D]
R70  0Ω/1%  [0402R_0.4D]
R73  68KΩ/1%  [0402R_0.4D]
R74  0Ω/1%  [0402R_0.4D]
R75  10KΩ/1%  [0402R_0.4D]
R76  0Ω/1%  [0402R_0.4D]
R77  10KΩ/1%  [0402R_0.4D]
R78  NC  [0402R_0.4D]
R79  10KΩ/1%  [0402R_0.4D]
R80  NC  [0402R_0.4D]
R81  10KΩ/1%  [0402R_0.4D]
R82  NC  [0402R_0.4D]
R83  0Ω/1%  [0402R_0.4D]
R84  0Ω/1%  [0402R_0.4D]
R88  产品型号: 0R  [0805R_0.6D]  (hidden comment: RES)
R90  产品型号: NC  [0805R_0.6D]  (hidden comment: RES)
R91  2.2KΩ  [0402R_0.4D]
R92  220Ω  [0402R_0.4D]
R93  2.2KΩ  [0402R_0.4D]
R94  0Ω/1%  [0402R_0.4D]
R95  68KΩ/1%  [0402R_0.4D]
R96  10KΩ/1%  [0402R_0.4D]
R97  产品型号: RC0402FR-074R7L  [0402R_0.4D]  (hidden comment: RES)
R99  0Ω/1%  [0402R_0.4D]
R101  0Ω/1%  [0402R_0.4D]
R102  0Ω/1%  [0402R_0.4D]
R104  0Ω/1%  [0402R_0.4D]
R105  0Ω/1%  [0402R_0.4D]
R106  0Ω/1%  [0402R_0.4D]
R107  0Ω/1%  [0402R_0.4D]
R108  0Ω/1%  [0402R_0.4D]
R109  0Ω/1%  [0402R_0.4D]
R113  0Ω/1%  [0402R_0.4D]
U7  ES8311  [QFN20(0.4)-3X3]
U9  MSM381ACT001  [麦克风MSM381ACT001]
U11  TPT29554A  [TSSOP-16(0.65)-5X6.6]
U12  CST8302A  [SOP-8(1.27)-GND]

### Nets
3.3V_8311: C61.2 R53.1 R55.2 R92.2 U9.1(VDD)
GND: C44.2 C53.1 C55.1 C69.2 C70.1 C92.2 R63.2 R66.1 R77.1 R79.1 R81.1 R88.2 U11.8(GND)
MIC_N: C37.1 C38.1 C39.1 C40.1 C41.1 C45.1 C46.1 C47.1 C48.1 C49.1 C50.1 C51.1 C52.1 C54.1 C56.1 C60.2 C61.1 C63.1 C64.1 C65.1 CON4.0 D8.A D9.K D12.A R35.1 R41.2 R63.1 R66.2 R90.1 R93.1 U7.0(PAD) U7.5(DGND) U7.10(AGND) U9.2(GND) U9.3(GND)  [also labelled AGND]
PAGND: C86.2 C87.2 C90.2 CON5.0 D7.K D11.A R88.1 R90.2 R96.1 U12.0(GND) U12.7(GND)
VDD_3V3: R33.2 R34.2 R50.2 R64.2 R78.2 R80.2 R82.2
VDD_PA: C86.1 C87.1 R75.2 U12.6(VDD)
A0: R77.2 R78.1 U11.1(A0)
A1: R79.2 R80.1 U11.2(A1)
A2: R81.2 R82.1 U11.3(A2)
AUD_N: C57.1 R51.2 ; off-sheet ES8311_OUTN  [also labelled ES8311_OUTN]
AUD_P: C58.1 R54.2 ; off-sheet ES8311_OUTP  [also labelled ES8311_OUTP]
Camera_RST: R17.1 ; off-sheet Camera_RST
CODEC_I2S0_BCLK: C51.2 R45.1 U7.6(SCLK/DMIC_SCL) ; off-sheet CODEC_I2S0_BCLK
CODEC_I2S0_DIN: C54.2 R47.1 U7.7(ASDOUT) ; off-sheet CODEC_I2S0_DIN
CODEC_I2S0_DOUT: C56.2 R49.1 U7.9(DSDIN) ; off-sheet CODEC_I2S0_DOUT
CODEC_I2S0_LRCK: C52.2 R48.1 U7.8(LRCK) ; off-sheet CODEC_I2S0_LRCK
CODEC_I2S0_MCLK: C50.2 R43.1 U7.2(MCLK) ; off-sheet CODEC_I2S0_MCLK
D0: R106.1 ; off-sheet D0
D1: R107.1 ; off-sheet D1
D2: R108.1 ; off-sheet D2
D3: R109.1 ; off-sheet D3
D4: R16.1 ; off-sheet D4
D5: R9.1 ; off-sheet D5
D6: R2.1 ; off-sheet D6
D7: R1.1 ; off-sheet D7
GPIO1: R45.2
GPIO2: R106.2
GPIO3: R104.2
GPIO4: R76.2 R109.2
GPIO5: C44.1 R50.1 R52.2
GPIO6: R102.2
GPIO7: R99.2
GPIO8: R105.2
GPIO9: R107.2
GPIO10: R17.2
GPIO11: C92.1 R113.2
GPIO12: R57.2
GPIO13: R108.2
GPIO14: R47.2
GPIO15: R48.2
GPIO16: R33.1 R39.2
GPIO18: R34.1 R40.2
GPIO43: R16.2 R70.2
GPIO44: R9.2 R74.2
GPIO45: R49.2
GPIO46: R43.2
GPIO47: R1.2 R65.2
GPIO48: R2.2 R68.2
HSYNC: R102.1 ; off-sheet HSYNC
I2C0_SCL: R40.1 R44.1 R84.2 ; off-sheet I2C0_SCL
I2C0_SDA: R39.1 R42.1 R83.2 ; off-sheet I2C0_SDA
KEY_ADC: R52.1 ; off-sheet KEY_ADC
LCD_CLK: R74.1 ; off-sheet LCD_CLK
LCD_CS1: R65.1 ; off-sheet LCD_CS1
LCD_D0: R68.1 ; off-sheet LCD_D0
LCD_D1: R70.1 ; off-sheet LCD_D1
LCD_LED: R60.1 ; off-sheet LCD_LED
LCD_RST: R67.1 ; off-sheet LCD_RST
LCD_TE: R76.1 ; off-sheet LCD_TE
MCLK: R104.1 ; off-sheet MCLK
MIC_N_OUT: C62.1 C64.2 CON4.1 D12.K R46.1 R93.2
MIC_P: C63.2 D8.K R38.2 U9.4(OUT)
MIC_P_OUT: C62.2 C65.2 CON4.2 D9.A R32.2 R91.1
MUTE: R69.1 R94.1 ; off-sheet MUTE
OUTN: C91.1 R25.1 U12.5(OUTN)
OUTP: R24.1 R97.2 U12.8(OUTP)
P0: U11.4(P0)
P1: U11.5(P1)
P2: U11.6(P2)
P3: R67.2 U11.7(P3)
P4: R58.2 U11.9(P4)
P5: R60.2 U11.10(P5)
P6: R69.2 U11.11(P6)
P7: R101.2 U11.12(P7)
PCLK: R105.1 ; off-sheet PCLK
PWDN: R101.1 ; off-sheet PWDN
TP_INT: R57.1 ; off-sheet TP_INT
TP_RST: R58.1 ; off-sheet TP_RST
VBAT_ADC: R113.1 ; off-sheet VBAT_ADC
VSYNC: R99.1 ; off-sheet VSYNC
NetC35_1: C35.1 U7.18(MIC1P/DMIC_SDA)
NetC35_2: C35.2 R32.1 R38.1
NetC36_1: C36.1 U7.17(MIC1N)
NetC36_2: C36.2 R41.1 R46.2
NetC37_2: C37.2 R42.2 U7.19(CDATA)
NetC38_2: C38.2 U7.16(VMID)
NetC39_2: C39.2 U7.15(ADCVREF)
NetC40_2: C40.2 R44.2 U7.1(CCLK)
NetC41_2: C41.2 U7.14(DACVREF)
NetC42_1: C42.1 R51.1
NetC42_2: C42.2 U7.13(OUTN)
NetC43_1: C43.1 R54.1
NetC43_2: C43.2 U7.12(OUTP)
NetC45_2: C45.2 C46.2 C47.2 R53.2 U7.3(PVDD) U7.4(DVDD)
NetC48_2: C48.2 C49.2 R55.1 U7.11(AVDD)
NetC53_2: C53.2 C55.2 R64.1 U11.16(VCC)
NetC57_2: C57.2 R73.1
NetC58_2: C58.2 R95.1
NetC60_1: C60.1 R91.2 R92.1
NetC69_1: C69.1 R83.1 U11.15(SDA)
NetC70_2: C70.2 R84.1 U11.14(SCL)
NetC90_1: C90.1 U12.2(BYPASS)
NetC91_2: C91.2 R97.1
NetCON5_1: CON5.1 D11.K R25.2
NetCON5_2: CON5.2 D7.A R24.2
NetR35_2: R35.2 U7.20(CE)
NetR73_2: R73.2 U12.4(INN)
NetR75_1: R75.1 R94.2 R96.2 U12.1(SD)
NetR95_2: R95.2 U12.3(INP)

Not connected (* = marked no-connect by the designer): U11 13(#INT)

### Notes on the sheet
- (near R34) 靠近模组放置
- ES8311
- (near R35) I2C Address
- (near R35) 0x18
- IO &Expansion
- (near R38) 共用焊盘
- (near R41) 共用焊盘
- ADC
- 靠近模组放置
- I2C Address
- (near U11) 0x20
- PA使能
- (near C92) 靠近模组放置
- MIC
- Fc=1/(2*pi*Rin*Cin)=4.98 Hz
- Av=300/Rin=4.41 v/v
- (near R94) PA
- 1.5mm/2Pin/Vertical
- PCB名称:
- WiFi+LoRa双模主控模组开发板
- PCB型号:
- L-LRMAM36-FANN4-DK01
- 制图人员:
- 审核人员:
- 立项编号:
- NXL
- LXY
- 制图日期:
- 审核日期:
- 260326
- 260327
- 纸张型号:
- 共__页  第__页
- PCB版本:
- 4
- V01
- A3
- 3
- Labels drawn without touching a wire or pin: AGND

### Library data of the parts
C35 C36 C45 C49 C53 = 1405001497: 2.2uF/6.3V/20%/X5R; 产品型号: CL05A225MQ5NNNC; 品名: 陶瓷电容; 原厂品牌: SAMSUNG电容; 封装: 0402; 物料状态: 优选; 存货编码: 1405001497
C37 C40 C50-C52 C54 C56 C69 C70 = 1405001320: 22pF/50V/5%/C0G; 产品型号: V220J0402C0G500NBT; 品名: 陶瓷电容; 原厂品牌: 微容VIIYONG; 封装: 0402; 物料状态: 优选; 存货编码: 1405001320
C38 C39 C41-C43 C90 = 1405004038: as C17 on sheet 03_Power_260316_V02; 存货编码: 1405004038
C44 C46-C48 C55 C60 C61 C87 C92 = 1405001287: 0.1uF/16V/10%/X7R; 产品型号: V104K0402X7R160NBT; 品名: 陶瓷电容; 原厂品牌: 微容VIIYONG; 封装: 0402; 物料状态: 优选; 存货编码: 1405001287
C57 C58 = 1405001368: 0.47uF/10V/10%/X5R; 产品型号: V474K0402X5R100NNT; 品名: 陶瓷电容; 原厂品牌: 微容VIIYONG; 封装: 0402; 物料状态: 优选; 存货编码: 1405001368
C62 = 1405001380: 33pF/50V/5%/C0G; 产品型号: V330J0402C0G500NBT; 品名: 陶瓷电容; 原厂品牌: 微容VIIYONG; 封装: 0402; 物料状态: 优选; 存货编码: 1405001380
C63 = 1405001303: 15pF/50V/5%/C0G; 产品型号: V150J0402C0G500NBT; 品名: 陶瓷电容; 原厂品牌: 微容VIIYONG; 封装: 0402; 物料状态: 优选; 存货编码: 1405001303
C64 C65 C91 = 1405001283: 1nF/50V/5%/C0G; 产品型号: V102J0402C0G500NBT; 品名: 陶瓷电容; 原厂品牌: 微容VIIYONG; 封装: 0402; 物料状态: 优选; 存货编码: 1405001283
C86 = 1405001308: 10uF/10V/20%/X5R; 产品型号: CL05A106MP5NUNC; 品名: 陶瓷电容; 原厂品牌: SAMSUNG电容; 封装: 0402; 物料状态: 优选; 存货编码: 1405001308
CON4 = 1416001814: as CON3 on sheet 03_Power_260316_V02; 产品型号: 1.25mm/2PIN; 存货编码: 1416001814
CON5 = 1416003013: 1.25mm/2PIN; 产品型号: CNT-W125-1*2-TSM; 品名: 线对板连接器; 原厂品牌: 肯耐特; 封装: SMD; 物料状态: 优选; 存货编码: 1416003013
D7 D9 D11 D12 = 1409004678: 1通道/5V/6.5V/40W/0.32pF; 品名: ESD保护器件; 原厂品牌: BF TECH; 封装: DFN1006-2L; 物料状态: 优选; 存货编码: 1409004678
D8 = 1409004149: 1通道; 产品型号: WS05DPF-BH; 品名: ESD保护器件; 原厂品牌: WAYON（维安）; 封装: DFN1006-2L; 物料状态: 优选; 存货编码: 1409004149
R1 R2 R9 R16 R17 R32 R38-R49 R51-R55 R57 R58 R60 R64 R65 R67-R70 R74 R76 R83 R84 R94 R99 R101 R102 R104-R109 R113 = 1408000124: as R14 on sheet 03_Power_260316_V02; 存货编码: 1408000124
R24 R25 = 1408001205: 68KΩ/1%; 产品型号: RC0402FR-0768KL; 品名: 厚膜贴片电阻; 原厂品牌: YAGEO; 封装: 0402; 物料状态: 优选; 存货编码: 1408001205
R33 R34 R91 R93 = 1408000457: 2.2KΩ/5%; 产品型号: 0402WGJ0222TCE; 品名: 厚膜贴片电阻; 原厂品牌: Uniohm; 封装: 0402; 物料状态: 优选; 存货编码: 1408000457
R35 R50 R75 R77 R79 R81 R96 = 1408000127: as R28 on sheet 04_Function_260316_V02; 存货编码: 1408000127
R63 R66 R88 R90 = 1408000487: as R103 on sheet 03_Power_260316_V02; 存货编码: 1408000487
R73 R95 = 1408001205: 产品型号: RC0402FR-0768KL; 品名: 厚膜贴片电阻; 原厂品牌: YAGEO; 封装: 0402; 物料状态: 优选; 存货编码: 1408001205
R78 R80 R82 = 1408000127: 10KΩ/1%; 产品型号: 0402WGF1002TCE; 品名: 厚膜贴片电阻; 原厂品牌: Uniohm; 封装: 0402; 物料状态: 优选; 存货编码: 1408000127
R92 = 1408006269: 220Ω/5%; 产品型号: 0402WGJ0221TCE; 品名: 厚膜贴片电阻; 原厂品牌: Uniohm; 封装: 0402; 物料状态: 优选; 存货编码: 1408006269
R97 = 1408001377: 4.7Ω/1%; 品名: 厚膜贴片电阻; 原厂品牌: YAGEO; 封装: 0402; 物料状态: 优选; 存货编码: 1408001377
U7 = ES8311: QFN20-3*3mm
U9 = SI-MIC: 1406000322
U11 = TCA9554PWR: IO扩展芯片

## Sheet 06_LCD&Camera_interface.SchDoc
size A3
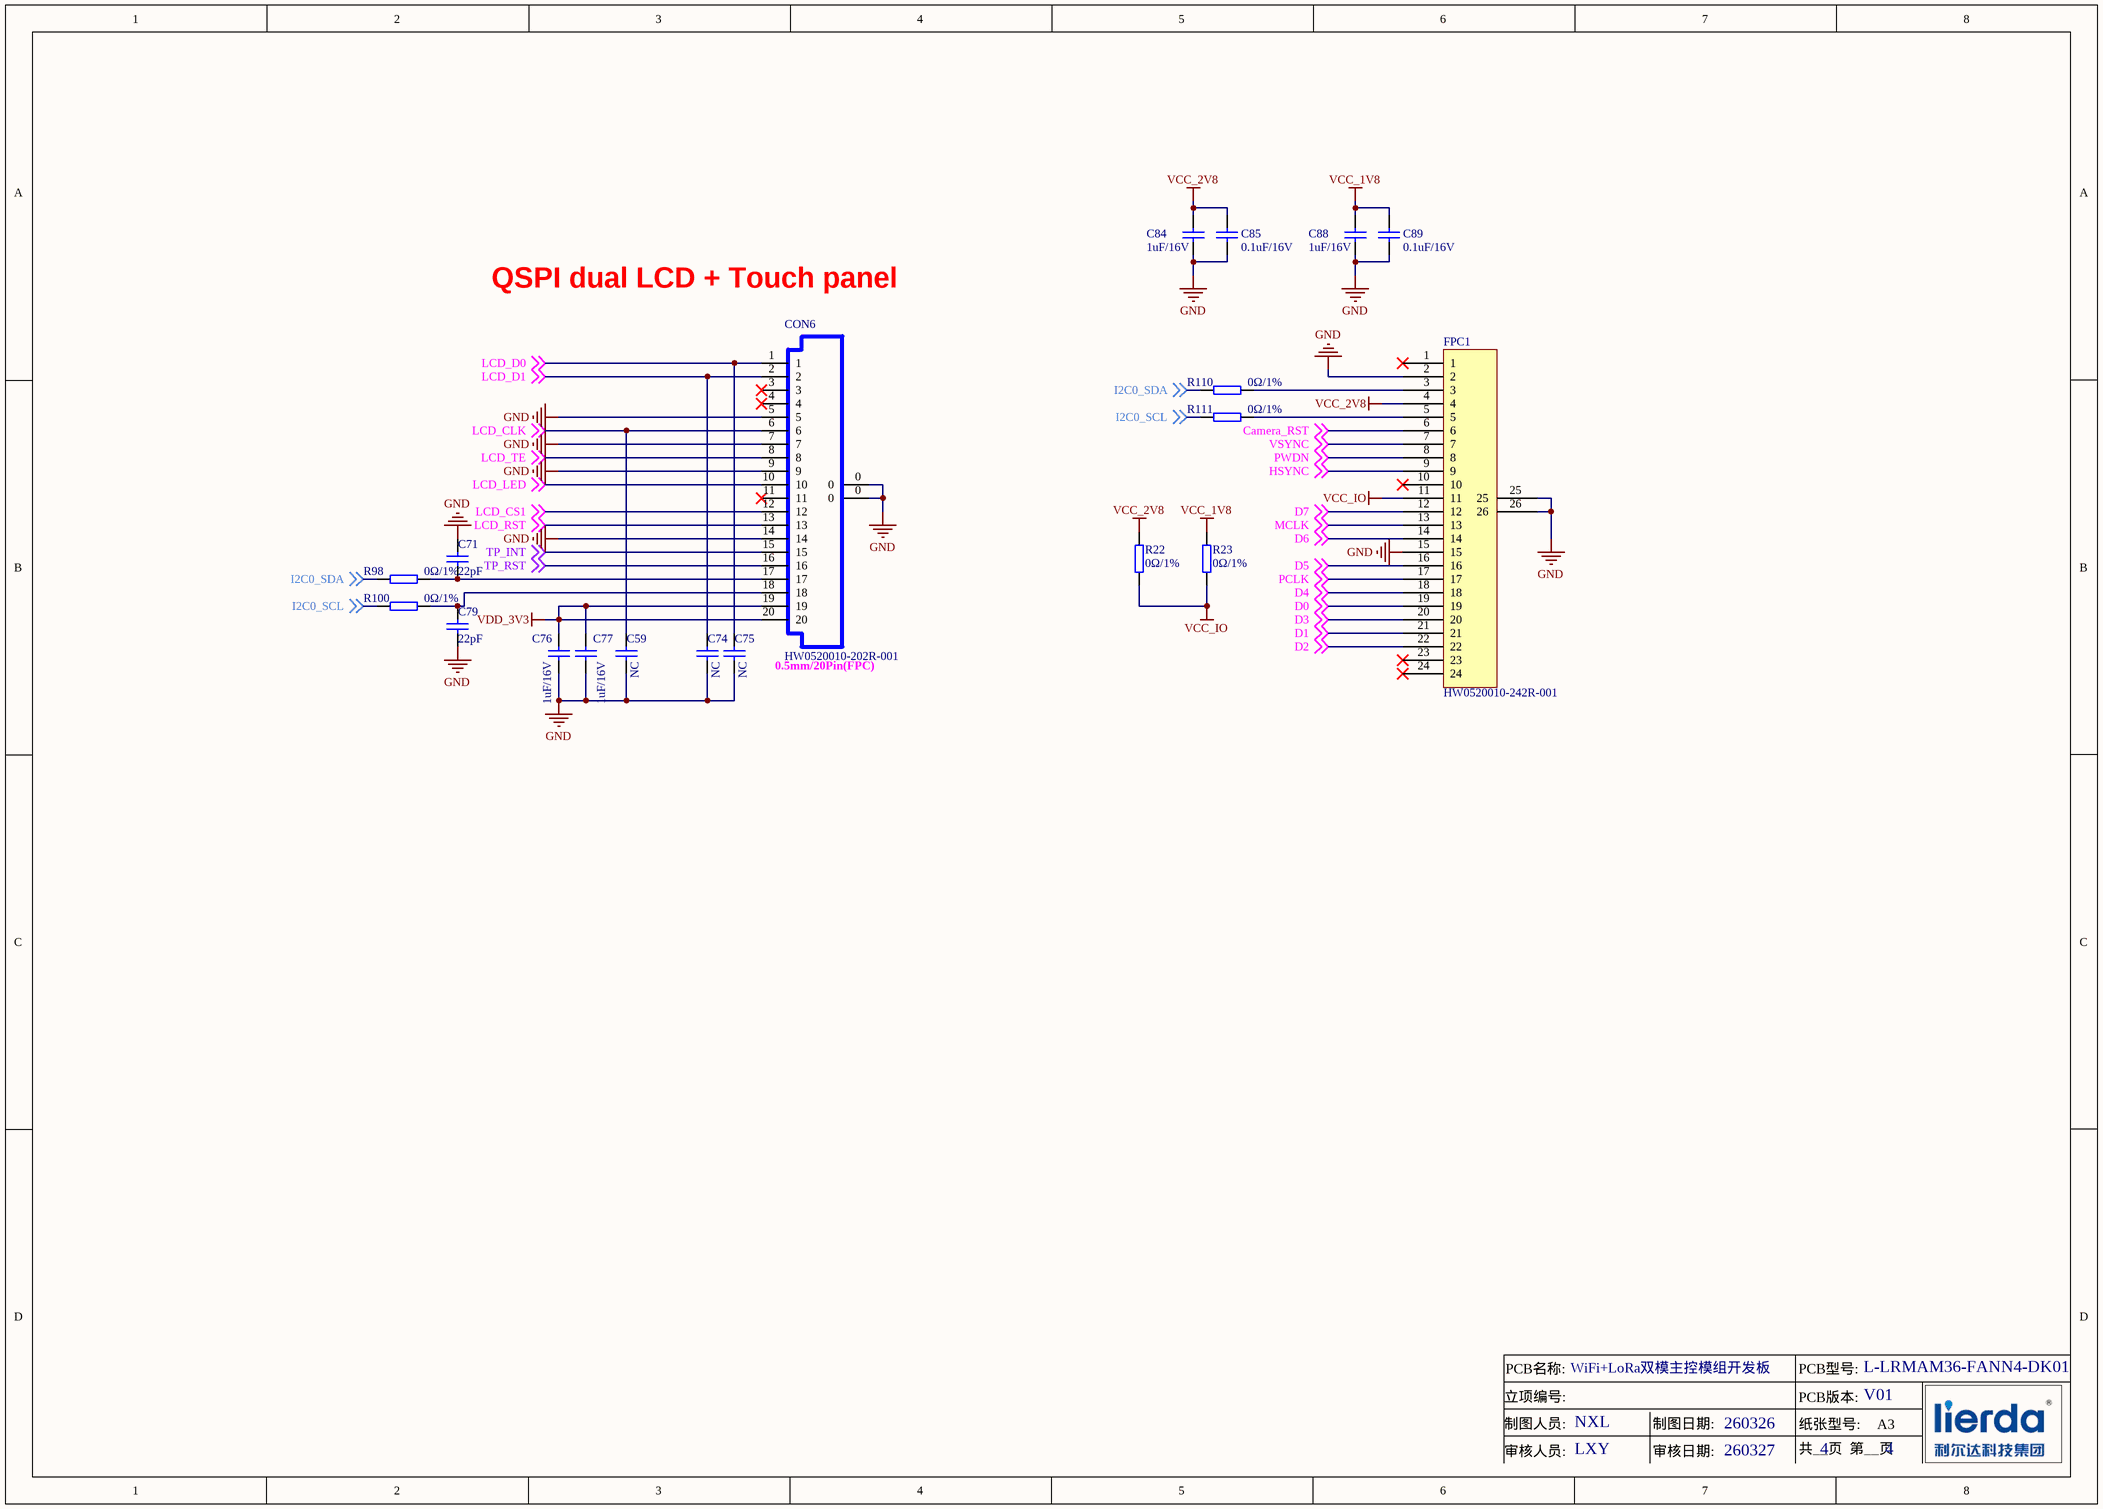
[diagram p5: 06_LCD&Camera_interface.SchDoc]

### Parts
C59  NC  [0402C_0.4D]
C71  22pF  [0402C_0.4D]
C74  NC  [0402C_0.4D]
C75  NC  [0402C_0.4D]
C76  1uF/16V  [0402C_0.4D]
C77  1uF/16V  [0402C_0.4D]
C79  22pF  [0402C_0.4D]
C84  1uF/16V  [0402C_0.4D]
C85  0.1uF/16V  [0402C_0.4D]
C88  1uF/16V  [0402C_0.4D]
C89  0.1uF/16V  [0402C_0.4D]
CON6  HW0520010-202R-001  [FPC0.5E-20P]
FPC1  HW0520010-242R-001  [FPC0.5-24P]
R22  0Ω/1%  [0402R_0.4D]
R23  0Ω/1%  [0402R_0.4D]
R98  0Ω/1%  [0402R_0.4D]
R100  0Ω/1%  [0402R_0.4D]
R110  0Ω/1%  [0402R_0.4D]
R111  0Ω/1%  [0402R_0.4D]

### Nets
GND: C59.2 C71.2 C74.2 C75.2 C76.2 C77.2 C79.1 C84.2 C85.1 C88.2 C89.1 CON6.0 CON6.5 CON6.7 CON6.9 CON6.14 FPC1.2 FPC1.15 FPC1.25 FPC1.26
VCC_1V8: C88.1 C89.2 R23.2
VCC_2V8: C84.1 C85.2 FPC1.4 R22.2
VCC_IO: FPC1.11 R22.1 R23.1
VDD_3V3: C76.1 C77.1 CON6.19 CON6.20
Camera_RST: FPC1.6 ; off-sheet Camera_RST
D0: FPC1.19 ; off-sheet D0
D1: FPC1.21 ; off-sheet D1
D2: FPC1.22 ; off-sheet D2
D3: FPC1.20 ; off-sheet D3
D4: FPC1.18 ; off-sheet D4
D5: FPC1.16 ; off-sheet D5
D6: FPC1.14 ; off-sheet D6
D7: FPC1.12 ; off-sheet D7
HSYNC: FPC1.9 ; off-sheet HSYNC
I2C0_SCL: R100.1 R111.1 ; off-sheet I2C0_SCL
I2C0_SDA: R98.1 R110.1 ; off-sheet I2C0_SDA
LCD_CLK: C59.1 CON6.6 ; off-sheet LCD_CLK
LCD_CS1: CON6.12 ; off-sheet LCD_CS1
LCD_D0: C75.1 CON6.1 ; off-sheet LCD_D0
LCD_D1: C74.1 CON6.2 ; off-sheet LCD_D1
LCD_LED: CON6.10 ; off-sheet LCD_LED
LCD_RST: CON6.13 ; off-sheet LCD_RST
LCD_TE: CON6.8 ; off-sheet LCD_TE
MCLK: FPC1.13 ; off-sheet MCLK
PCLK: FPC1.17 ; off-sheet PCLK
PWDN: FPC1.8 ; off-sheet PWDN
TP_INT: CON6.15 ; off-sheet TP_INT
TP_RST: CON6.16 ; off-sheet TP_RST
VSYNC: FPC1.7 ; off-sheet VSYNC
NetC71_1: C71.1 CON6.17 R98.2
NetC79_2: C79.2 CON6.18 R100.2
NetFPC1_3: FPC1.3 R110.2
NetFPC1_5: FPC1.5 R111.2

Not connected (* = marked no-connect by the designer): CON6 3* 4* 11*; FPC1 1* 10* 23* 24*

### Notes on the sheet
- QSPI dual LCD + Touch panel
- 0.5mm/20Pin(FPC)
- PCB名称:
- WiFi+LoRa双模主控模组开发板
- PCB型号:
- L-LRMAM36-FANN4-DK01
- 制图人员:
- 审核人员:
- 立项编号:
- NXL
- LXY
- 制图日期:
- 审核日期:
- 260326
- 260327
- 纸张型号:
- 共__页  第__页
- PCB版本:
- 4
- V01
- A3

### Library data of the parts
C59 C74-C77 C84 C88 = 1405004038: as C17 on sheet 03_Power_260316_V02; 存货编码: 1405004038
C71 C79 = 1405001320: as C37 on sheet 05_Codec&PA; 存货编码: 1405001320
C85 C89 = 1405000464: as C2 on sheet 04_Function_260316_V02; 存货编码: 1405000464
CON6 = 1416002856: 0.50mm/20PIN; 产品型号: 60030-2001-5002; 品名: FFC，FPC连接器; 原厂品牌: 新富尔; 封装: SMD; 物料状态: 优选; 存货编码: 1416002856
R22 R23 R98 R100 R110 R111 = 1408000124: as R14 on sheet 03_Power_260316_V02; 存货编码: 1408000124

## Nets that join several sheets
3.3V_8311: 03_Power_260316_V02 (R14.2 TP_LDO1.1), 05_Codec&PA (5 pins)
GND: 03_Power_260316_V02 (43 pins), 04_Function_260316_V02 (49 pins), 05_Codec&PA (13 pins), 06_LCD&Camera_interface (20 pins)
MIC_N: 03_Power_260316_V02 (C29.1 C30.1 C31.1 U6.2), 05_Codec&PA (35 pins)
PAGND: 03_Power_260316_V02 (C81.1), 05_Codec&PA (11 pins)
V5P0: 03_Power_260316_V02 (21 pins), 04_Function_260316_V02 (R18.2 R19.2 R21.2)
VCC_1V8: 03_Power_260316_V02 (C25.2 U5.2 VDD_1V8.1), 06_LCD&Camera_interface (C88.1 C89.2 R23.2)
VCC_2V8: 03_Power_260316_V02 (C82.2 U10.1 VDD_2V8.1), 06_LCD&Camera_interface (C84.1 C85.2 FPC1.4 R22.2)
VDD_3V3: 03_Power_260316_V02 (R13.1 VDD_WiFi.1), 04_Function_260316_V02 (6 pins), 05_Codec&PA (7 pins), 06_LCD&Camera_interface (C76.1 C77.1 CON6.19 CON6.20)
VDD_PA: 03_Power_260316_V02 (C81.2 R103.1 VDD_PA.1), 05_Codec&PA (C86.1 C87.1 R75.2 U12.6)
Camera_RST: 05_Codec&PA (R17.1), 06_LCD&Camera_interface (FPC1.6)
D0: 05_Codec&PA (R106.1), 06_LCD&Camera_interface (FPC1.19)
D1: 05_Codec&PA (R107.1), 06_LCD&Camera_interface (FPC1.21)
D2: 05_Codec&PA (R108.1), 06_LCD&Camera_interface (FPC1.22)
D3: 05_Codec&PA (R109.1), 06_LCD&Camera_interface (FPC1.20)
D4: 05_Codec&PA (R16.1), 06_LCD&Camera_interface (FPC1.18)
D5: 05_Codec&PA (R9.1), 06_LCD&Camera_interface (FPC1.16)
D6: 05_Codec&PA (R2.1), 06_LCD&Camera_interface (FPC1.14)
D7: 05_Codec&PA (R1.1), 06_LCD&Camera_interface (FPC1.12)
GPIO1: 04_Function_260316_V02 (M1.32), 05_Codec&PA (R45.2)
GPIO2: 04_Function_260316_V02 (M1.31), 05_Codec&PA (R106.2)
GPIO3: 04_Function_260316_V02 (M1.30), 05_Codec&PA (R104.2)
GPIO4: 04_Function_260316_V02 (M1.29), 05_Codec&PA (R76.2 R109.2)
GPIO5: 04_Function_260316_V02 (M1.28), 05_Codec&PA (C44.1 R50.1 R52.2)
GPIO6: 04_Function_260316_V02 (M1.27), 05_Codec&PA (R102.2)
GPIO7: 04_Function_260316_V02 (M1.26), 05_Codec&PA (R99.2)
GPIO8: 04_Function_260316_V02 (M1.25), 05_Codec&PA (R105.2)
GPIO9: 04_Function_260316_V02 (M1.3), 05_Codec&PA (R107.2)
GPIO10: 04_Function_260316_V02 (M1.4), 05_Codec&PA (R17.2)
GPIO11: 04_Function_260316_V02 (M1.5), 05_Codec&PA (C92.1 R113.2)
GPIO12: 04_Function_260316_V02 (M1.6), 05_Codec&PA (R57.2)
GPIO13: 04_Function_260316_V02 (M1.7), 05_Codec&PA (R108.2)
GPIO14: 04_Function_260316_V02 (M1.8), 05_Codec&PA (R47.2)
GPIO15: 04_Function_260316_V02 (M1.10), 05_Codec&PA (R48.2)
GPIO16: 04_Function_260316_V02 (M1.11), 05_Codec&PA (R33.1 R39.2)
GPIO18: 04_Function_260316_V02 (M1.12), 05_Codec&PA (R34.1 R40.2)
GPIO43: 04_Function_260316_V02 (M1.23), 05_Codec&PA (R16.2 R70.2)
GPIO44: 04_Function_260316_V02 (M1.22), 05_Codec&PA (R9.2 R74.2)
GPIO45: 04_Function_260316_V02 (M1.21), 05_Codec&PA (R49.2)
GPIO46: 04_Function_260316_V02 (M1.20), 05_Codec&PA (R43.2)
GPIO47: 04_Function_260316_V02 (M1.18), 05_Codec&PA (R1.2 R65.2)
GPIO48: 04_Function_260316_V02 (M1.19), 05_Codec&PA (R2.2 R68.2)
HSYNC: 05_Codec&PA (R102.1), 06_LCD&Camera_interface (FPC1.9)
I2C0_SCL: 05_Codec&PA (R40.1 R44.1 R84.2), 06_LCD&Camera_interface (R100.1 R111.1)
I2C0_SDA: 05_Codec&PA (R39.1 R42.1 R83.2), 06_LCD&Camera_interface (R98.1 R110.1)
KEY_ADC: 04_Function_260316_V02 (8 pins), 05_Codec&PA (R52.1)
LCD_CLK: 05_Codec&PA (R74.1), 06_LCD&Camera_interface (C59.1 CON6.6)
LCD_CS1: 05_Codec&PA (R65.1), 06_LCD&Camera_interface (CON6.12)
LCD_D0: 05_Codec&PA (R68.1), 06_LCD&Camera_interface (C75.1 CON6.1)
LCD_D1: 05_Codec&PA (R70.1), 06_LCD&Camera_interface (C74.1 CON6.2)
LCD_LED: 05_Codec&PA (R60.1), 06_LCD&Camera_interface (CON6.10)
LCD_RST: 05_Codec&PA (R67.1), 06_LCD&Camera_interface (CON6.13)
LCD_TE: 05_Codec&PA (R76.1), 06_LCD&Camera_interface (CON6.8)
MCLK: 05_Codec&PA (R104.1), 06_LCD&Camera_interface (FPC1.13)
P0: 04_Function_260316_V02 (R56.1), 05_Codec&PA (U11.4)
P1: 04_Function_260316_V02 (R59.1), 05_Codec&PA (U11.5)
P2: 04_Function_260316_V02 (R61.1), 05_Codec&PA (U11.6)
PCLK: 05_Codec&PA (R105.1), 06_LCD&Camera_interface (FPC1.17)
POWER_KEY: 03_Power_260316_V02 (U20.3), 04_Function_260316_V02 (C2.2 K3.2 KEY7.1)
PWDN: 05_Codec&PA (R101.1), 06_LCD&Camera_interface (FPC1.8)
TP_INT: 05_Codec&PA (R57.1), 06_LCD&Camera_interface (CON6.15)
TP_RST: 05_Codec&PA (R58.1), 06_LCD&Camera_interface (CON6.16)
USB2_N: 03_Power_260316_V02 (U3.4), 04_Function_260316_V02 (L1.2 R7.2)
USB2_P: 03_Power_260316_V02 (U3.6), 04_Function_260316_V02 (L1.3 R6.1)
VBAT_ADC: 03_Power_260316_V02 (R114.1 R115.2), 05_Codec&PA (R113.1)
VSYNC: 05_Codec&PA (R99.1), 06_LCD&Camera_interface (FPC1.7)